# EAGLE schematic G80_a (EAGLE 8.2.2)
CPU-Board II auf Basis Modul G80 SoC von GHI-Electornics, LLC STM32F427xx

## Sheet 1 of 10: Prozessor
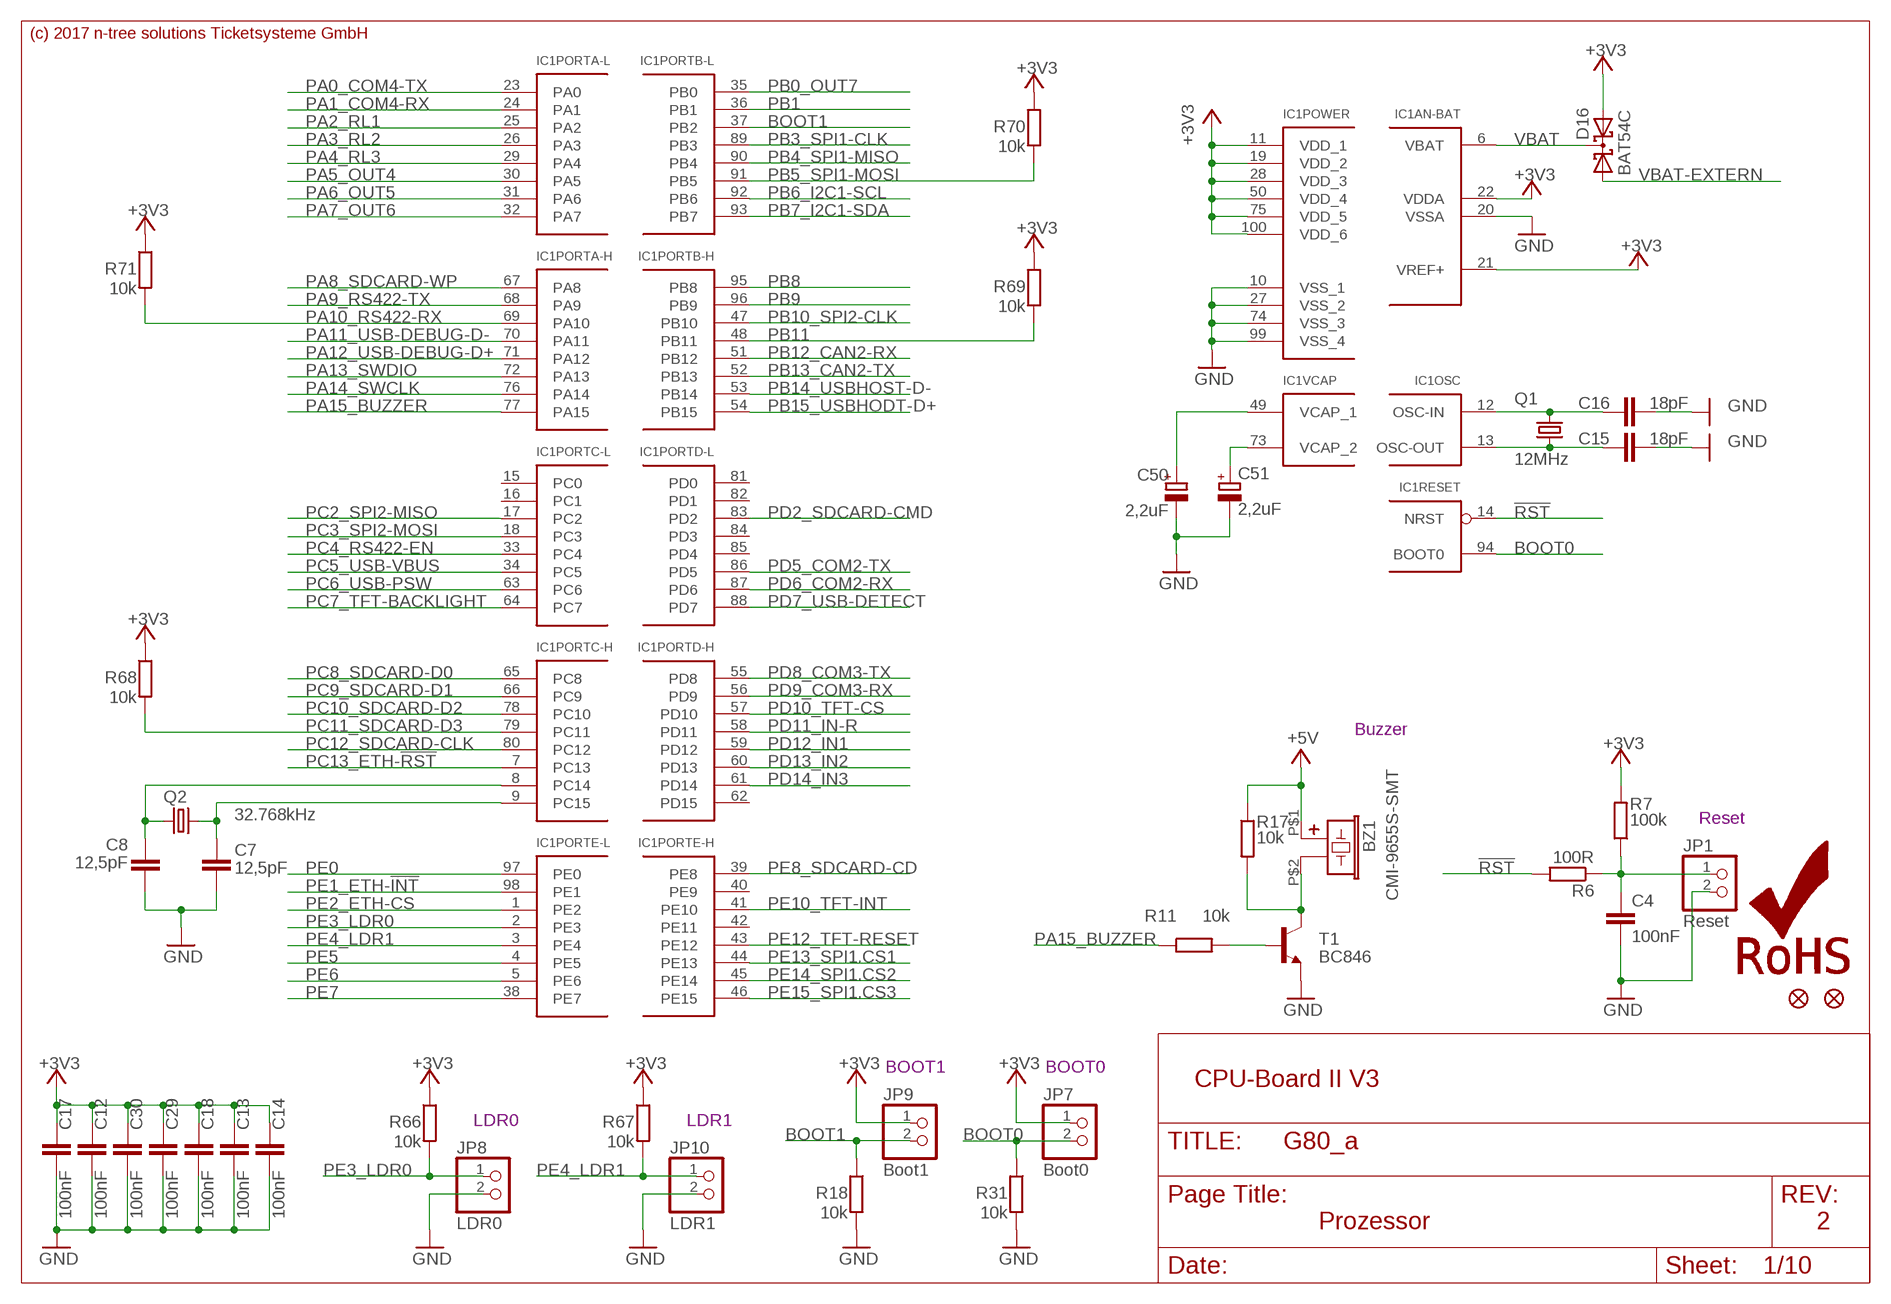
[diagram p0: schematic, sheet 1]

### Parts
BZ1  CMI-9655S-SMT  KTG0905CL  [KTG0905CL]
C4  100nF  C-EUC0603  [C0603]
C7  12,5pF  C-EUC0603  [C0603]
C8  12,5pF  C-EUC0603  [C0603]
C12  100nF  C-EUC0603  [C0603]
C13  100nF  C-EUC0603  [C0603]
C14  100nF  C-EUC0603  [C0603]
C15  18pF  C-EUC0603  [C0603]
C16  18pF  C-EUC0603  [C0603]
C17  100nF  C-EUC0603  [C0603]
C18  100nF  C-EUC0603  [C0603]
C29  100nF  C-EUC0603  [C0603]
C30  100nF  C-EUC0603  [C0603]
C50  2,2uF  CPOL-EUCT3216  [CT3216]
C51  2,2uF  CPOL-EUCT3216  [CT3216]
D16  BAT54C  [SOT23]
FID1  FIDUCIAL1X2  [FIDUCIAL-1X2]
FID2  FIDUCIAL1X2  [FIDUCIAL-1X2]
IC1  STM32F107  G80_SOC  [LQFP100]
JP1  Reset  PINHD-1X2  [1X02]
JP7  Boot0  PINHD-1X2  [1X02]
JP8  LDR0  PINHD-1X2  [1X02]
JP9  Boot1  PINHD-1X2  [1X02]
JP10  LDR1  PINHD-1X2  [1X02]
LOGO1  ROHS_LOGO  [ROHS_LOGO_0.18_IN]
Q1  12MHz  CRYSTALCTS406  [CTS406]
Q2  32.768kHz  CRYSTALS-NOGND-CFPX-217  [3.2X1.5-2-PAD]
R6  100R  R-EU_R0603  [R0603]
R7  100k  R-EU_R0603  [R0603]
R11  10k  R-EU_R0603  [R0603]
R17  10k  R-EU_R0603  [R0603]
R18  10k  R-EU_R0603  [R0603]
R31  10k  R-EU_R0603  [R0603]
R66  10k  R-EU_R0603  [R0603]
R67  10k  R-EU_R0603  [R0603]
R68  10k  R-EU_R0603  [R0603]
R69  10k  R-EU_R0603  [R0603]
R70  10k  R-EU_R0603  [R0603]
R71  10k  R-EU_R0603  [R0603]
T1  BC846  [SOT23]

### Nets
!RST: IC1.14(RESET:NRST) R6.2 ; also sheet 2
+3V3 [24V AC Signal]: C12.1 C13.1 C14.1 C17.1 C18.1 C29.1 C30.1 D16.2(A2) IC1.11(POWER:VDD_1) IC1.19(POWER:VDD_2) IC1.21(AN-BAT:VREF+) IC1.22(AN-BAT:VDDA) IC1.28(POWER:VDD_3) IC1.50(POWER:VDD_4) IC1.75(POWER:VDD_5) IC1.100(POWER:VDD_6) JP7.1 JP9.1 R7.2 R66.1 R67.1 R68.1 R69.1 R70.1 R71.1 ; also sheet 2,3,4,5,6,8,9,10
+5V [24V AC Signal]: BZ1.P$1 R17.1 ; also sheet 2,4,5,6,7,8,9,10
BOOT0: IC1.94(RESET:BOOT0) JP7.2 R31.1
BOOT1: IC1.37(PORTB-L:PB2) JP9.2 R18.1
GND: C4.2 C7.2 C8.2 C12.2 C13.2 C14.2 C15.2 C16.2 C17.2 C18.2 C29.2 C30.2 C50.- C51.- IC1.10(POWER:VSS_1) IC1.20(AN-BAT:VSSA) IC1.27(POWER:VSS_2) IC1.74(POWER:VSS_3) IC1.99(POWER:VSS_4) JP1.2 JP8.2 JP10.2 R18.2 R31.2 T1.2(E) ; also sheet 2,3,4,5,6,8,9,10
N$1: C15.1 IC1.13(OSC:OSC-OUT) Q1.1
N$2: C16.1 IC1.12(OSC:OSC-IN) Q1.3
N$3: C7.1 IC1.9(PORTC-H:PC15) Q2.2
N$4: C8.1 IC1.8(PORTC-H:PC14) Q2.1
N$8: C51.+ IC1.73(VCAP:VCAP_2)
N$28: BZ1.P$2 R17.2 T1.3(C)
N$29: R11.2 T1.1(B)
N$31: C4.1 JP1.1 R6.1 R7.1
N$69: C50.+ IC1.49(VCAP:VCAP_1)
PA0_COM4-TX: IC1.23(PORTA-L:PA0) ; also sheet 4
PA1_COM4-RX: IC1.24(PORTA-L:PA1) ; also sheet 4
PA2_RL1: IC1.25(PORTA-L:PA2) ; also sheet 7
PA3_RL2: IC1.26(PORTA-L:PA3) ; also sheet 7
PA4_RL3: IC1.29(PORTA-L:PA4) ; also sheet 7
PA5_OUT4: IC1.30(PORTA-L:PA5) ; also sheet 2,7
PA6_OUT5: IC1.31(PORTA-L:PA6) ; also sheet 2,7
PA7_OUT6: IC1.32(PORTA-L:PA7) ; also sheet 2,7
PA8_SDCARD-WP: IC1.67(PORTA-H:PA8)
PA9_RS422-TX: IC1.68(PORTA-H:PA9) ; also sheet 9
PA10_RS422-RX: IC1.69(PORTA-H:PA10) R71.2 ; also sheet 9
PA11_USB-DEBUG-D-: IC1.70(PORTA-H:PA11) ; also sheet 6
PA12_USB-DEBUG-D+: IC1.71(PORTA-H:PA12) ; also sheet 6
PA13_SWDIO: IC1.72(PORTA-H:PA13) ; also sheet 2
PA14_SWCLK: IC1.76(PORTA-H:PA14) ; also sheet 2
PA15_BUZZER: IC1.77(PORTA-H:PA15) R11.1
PB0_OUT7: IC1.35(PORTB-L:PB0) ; also sheet 2,7
PB1: IC1.36(PORTB-L:PB1) ; also sheet 2
PB3_SPI1-CLK: IC1.89(PORTB-L:PB3) ; also sheet 2,5
PB4_SPI1-MISO: IC1.90(PORTB-L:PB4) ; also sheet 2,5
PB5_SPI1-MOSI: IC1.91(PORTB-L:PB5) R70.2 ; also sheet 2,5
PB6_I2C1-SCL: IC1.92(PORTB-L:PB6) ; also sheet 2,6
PB7_I2C1-SDA: IC1.93(PORTB-L:PB7) ; also sheet 2,6
PB8: IC1.95(PORTB-H:PB8) ; also sheet 2
PB9: IC1.96(PORTB-H:PB9) ; also sheet 2
PB10_SPI2-CLK: IC1.47(PORTB-H:PB10) ; also sheet 3
PB11: IC1.48(PORTB-H:PB11) R69.2 ; also sheet 2
PB12_CAN2-RX: IC1.51(PORTB-H:PB12) ; also sheet 2
PB13_CAN2-TX: IC1.52(PORTB-H:PB13) ; also sheet 2
PB14_USBHOST-D-: IC1.53(PORTB-H:PB14) ; also sheet 6
PB15_USBHODT-D+: IC1.54(PORTB-H:PB15) ; also sheet 6
PC2_SPI2-MISO: IC1.17(PORTC-L:PC2) ; also sheet 3
PC3_SPI2-MOSI: IC1.18(PORTC-L:PC3) ; also sheet 3
PC4_RS422-EN: IC1.33(PORTC-L:PC4) ; also sheet 9
PC5_USB-VBUS: IC1.34(PORTC-L:PC5) ; also sheet 6
PC6_USB-PSW: IC1.63(PORTC-L:PC6) ; also sheet 6
PC7_TFT-BACKLIGHT: IC1.64(PORTC-L:PC7) ; also sheet 5
PC8_SDCARD-D0: IC1.65(PORTC-H:PC8) ; also sheet 6
PC9_SDCARD-D1: IC1.66(PORTC-H:PC9) ; also sheet 6
PC10_SDCARD-D2: IC1.78(PORTC-H:PC10) ; also sheet 6
PC11_SDCARD-D3: IC1.79(PORTC-H:PC11) R68.2 ; also sheet 6
PC12_SDCARD-CLK: IC1.80(PORTC-H:PC12) ; also sheet 6
PC13_ETH-!RST: IC1.7(PORTC-H:PC13) ; also sheet 3
PD2_SDCARD-CMD: IC1.83(PORTD-L:PD2) ; also sheet 6
PD5_COM2-TX: IC1.86(PORTD-L:PD5) ; also sheet 4
PD6_COM2-RX: IC1.87(PORTD-L:PD6) ; also sheet 4
PD7_USB-DETECT: IC1.88(PORTD-L:PD7) ; also sheet 6
PD8_COM3-TX: IC1.55(PORTD-H:PD8) ; also sheet 4
PD9_COM3-RX: IC1.56(PORTD-H:PD9) ; also sheet 4
PD10_TFT-CS: IC1.57(PORTD-H:PD10) ; also sheet 5
PD11_IN-R: IC1.58(PORTD-H:PD11) ; also sheet 8
PD12_IN1: IC1.59(PORTD-H:PD12) ; also sheet 8
PD13_IN2: IC1.60(PORTD-H:PD13) ; also sheet 8
PD14_IN3: IC1.61(PORTD-H:PD14) ; also sheet 8
PE0: IC1.97(PORTE-L:PE0) ; also sheet 2
PE1_ETH-!INT: IC1.98(PORTE-L:PE1) ; also sheet 3
PE2_ETH-CS: IC1.1(PORTE-L:PE2) ; also sheet 3
PE3_LDR0: IC1.2(PORTE-L:PE3) JP8.1 R66.2
PE4_LDR1: IC1.3(PORTE-L:PE4) JP10.1 R67.2
PE5: IC1.4(PORTE-L:PE5) ; also sheet 2
PE6: IC1.5(PORTE-L:PE6) ; also sheet 2
PE7: IC1.38(PORTE-L:PE7) ; also sheet 2
PE8_SDCARD-CD: IC1.39(PORTE-H:PE8) ; also sheet 6
PE10_TFT-INT: IC1.41(PORTE-H:PE10) ; also sheet 5
PE12_TFT-RESET: IC1.43(PORTE-H:PE12) ; also sheet 5
PE13_SPI1.CS1: IC1.44(PORTE-H:PE13) ; also sheet 2
PE14_SPI1.CS2: IC1.45(PORTE-H:PE14) ; also sheet 2
PE15_SPI1.CS3: IC1.46(PORTE-H:PE15) ; also sheet 2
VBAT: D16.3(CC) IC1.6(AN-BAT:VBAT)
VBAT-EXTERN: D16.1(A1) ; also sheet 2
Unconnected: IC1.15(PORTC-L:PC0) IC1.16(PORTC-L:PC1) IC1.40(PORTE-H:PE9) IC1.42(PORTE-H:PE11) IC1.62(PORTD-H:PD15) IC1.81(PORTD-L:PD0) IC1.82(PORTD-L:PD1) IC1.84(PORTD-L:PD3) IC1.85(PORTD-L:PD4)

### Notes on the sheet
- (c) 2017 n-tree solutions Ticketsysteme GmbH
- Buzzer
- Reset
- BOOT1 | BOOT0
- CPU-Board II V3
- LDR0 | LDR1
- Prozessor | 2

## Sheet 2 of 10: Extern
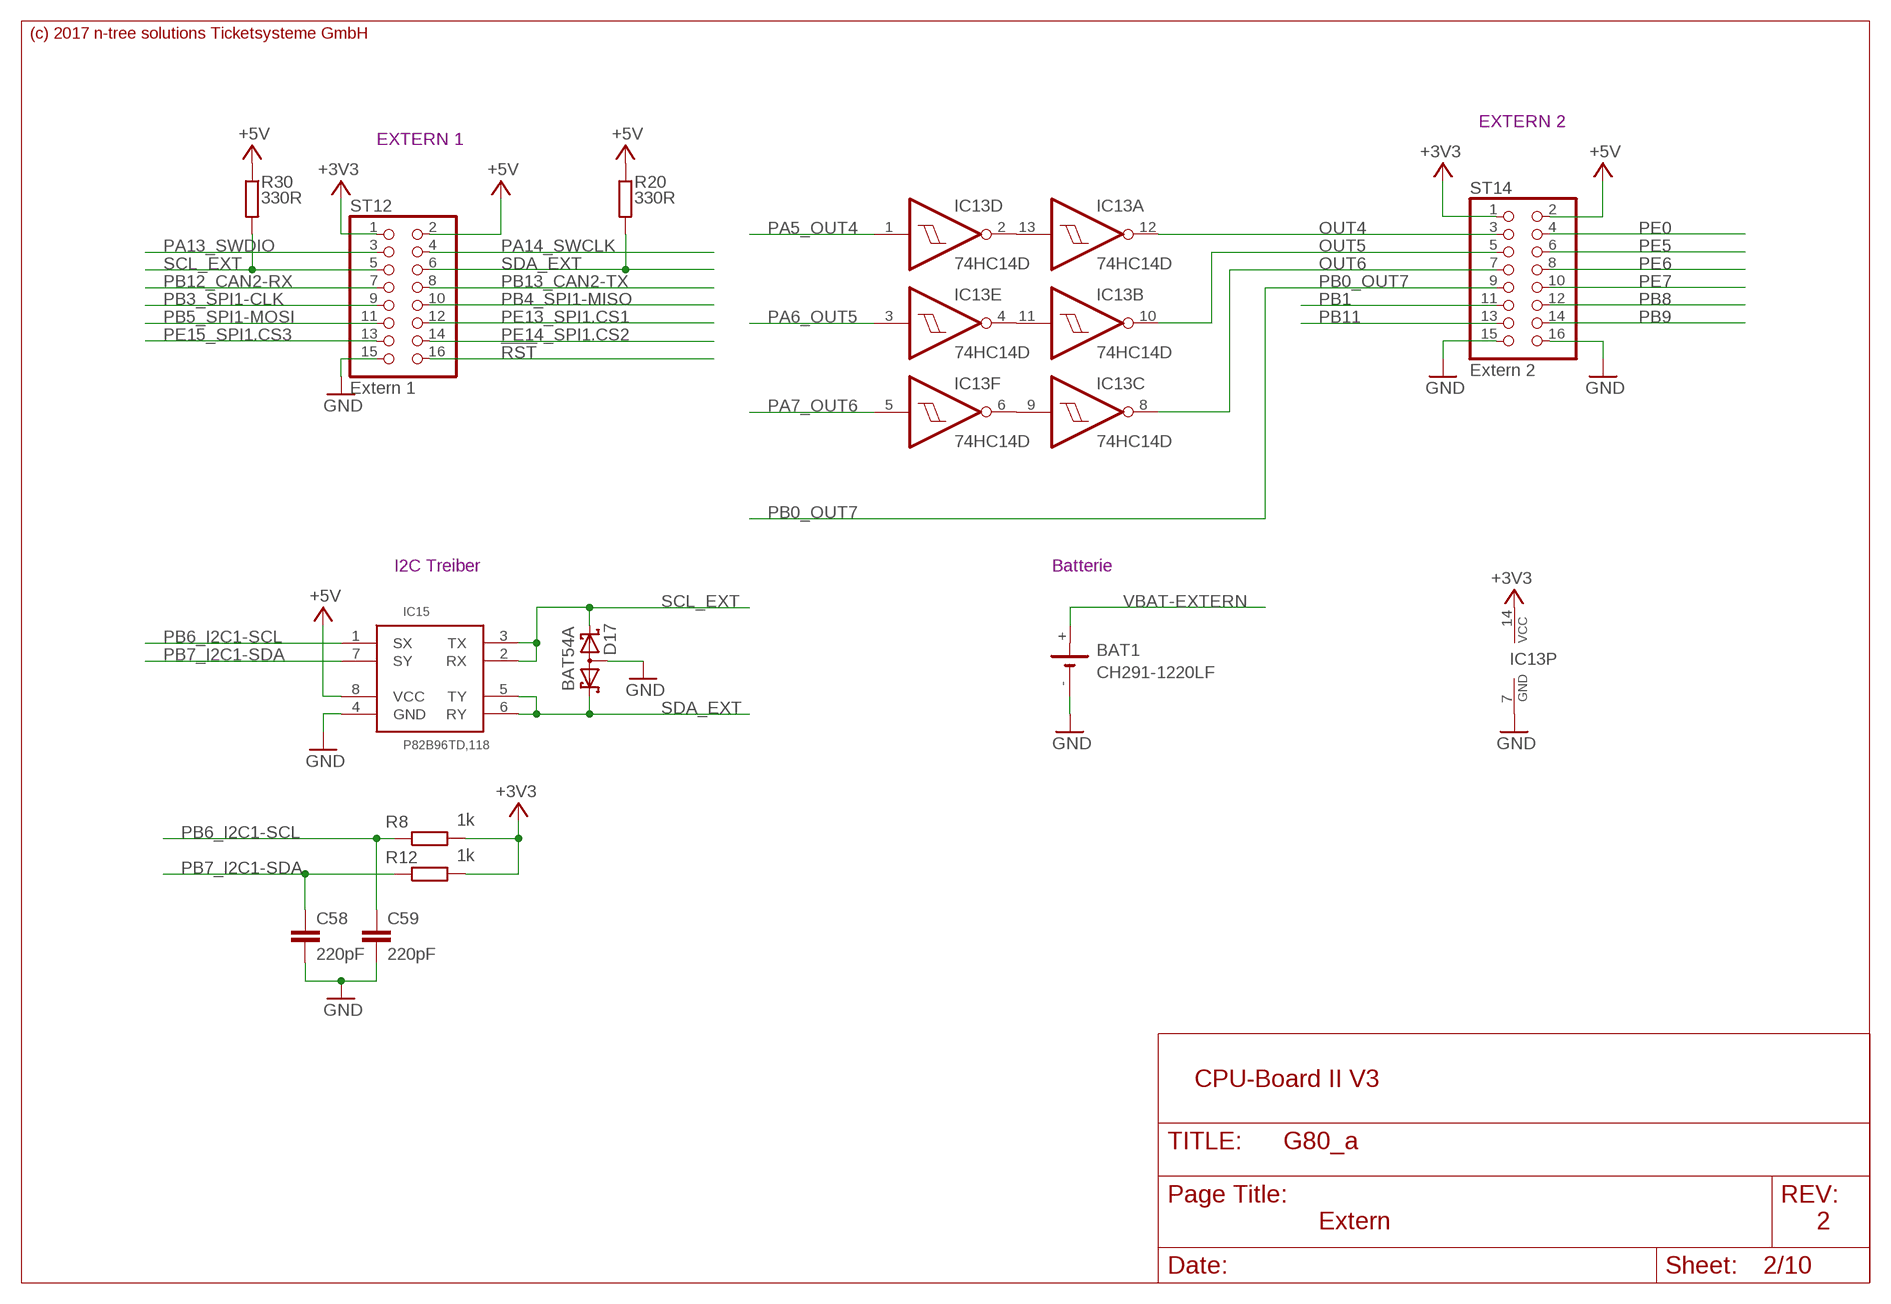
[diagram p1: schematic, sheet 2]

### Parts
BAT1  CH291-1220LF  [CH291-1220LF]
C58  220pF  C-EUC0603  [C0603]
C59  220pF  C-EUC0603  [C0603]
D17  BAT54A  [SOT23]
IC13  74HC14D  [SO14]
IC15  P82B96TD,118  P82B96'SO8'  [SO08]
R8  1k  R-EU_R0603  [R0603]
R12  1k  R-EU_R0603  [R0603]
R20  330R  R-EU_R0603  [R0603]
R30  330R  R-EU_R0603  [R0603]
ST12  Extern 1  PINHD-2X8  [2X08]
ST14  Extern 2  PINHD-2X8  [2X08]

### Nets
!RST: ST12.16 ; also sheet 1
+3V3 [24V AC Signal]: IC13.14(P:VCC) R8.2 R12.2 ST12.1 ST14.1 ; also sheet 1,3,4,5,6,8,9,10
+5V [24V AC Signal]: IC15.8(VCC) R20.1 R30.1 ST12.2 ST14.2 ; also sheet 1,4,5,6,7,8,9,10
GND: BAT1.- C58.2 C59.2 D17.3(AA) IC13.7(P:GND) IC15.4(GND) ST12.15 ST14.15 ST14.16 ; also sheet 1,3,4,5,6,8,9,10
N$94: IC13.2(D:O) IC13.13(A:I)
N$100: IC13.4(E:O) IC13.11(B:I)
N$103: IC13.6(F:O) IC13.9(C:I)
OUT4: IC13.12(A:O) ST14.3 ; also sheet 7
OUT5: IC13.10(B:O) ST14.5 ; also sheet 7
OUT6: IC13.8(C:O) ST14.7 ; also sheet 7
PA5_OUT4: IC13.1(D:I) ; also sheet 1,7
PA6_OUT5: IC13.3(E:I) ; also sheet 1,7
PA7_OUT6: IC13.5(F:I) ; also sheet 1,7
PA13_SWDIO: ST12.3 ; also sheet 1
PA14_SWCLK: ST12.4 ; also sheet 1
PB0_OUT7: ST14.9 ; also sheet 1,7
PB1: ST14.11 ; also sheet 1
PB3_SPI1-CLK: ST12.9 ; also sheet 1,5
PB4_SPI1-MISO: ST12.10 ; also sheet 1,5
PB5_SPI1-MOSI: ST12.11 ; also sheet 1,5
PB6_I2C1-SCL: C59.1 IC15.1(SX) R8.1 ; also sheet 1,6
PB7_I2C1-SDA: C58.1 IC15.7(SY) R12.1 ; also sheet 1,6
PB8: ST14.12 ; also sheet 1
PB9: ST14.14 ; also sheet 1
PB11: ST14.13 ; also sheet 1
PB12_CAN2-RX: ST12.7 ; also sheet 1
PB13_CAN2-TX: ST12.8 ; also sheet 1
PE0: ST14.4 ; also sheet 1
PE5: ST14.6 ; also sheet 1
PE6: ST14.8 ; also sheet 1
PE7: ST14.10 ; also sheet 1
PE13_SPI1.CS1: ST12.12 ; also sheet 1
PE14_SPI1.CS2: ST12.14 ; also sheet 1
PE15_SPI1.CS3: ST12.13 ; also sheet 1
SCL_EXT: D17.2(K2) IC15.2(RX) IC15.3(TX) R30.2 ST12.5
SDA_EXT: D17.1(K1) IC15.5(TY) IC15.6(RY) R20.2 ST12.6
VBAT-EXTERN: BAT1.+ ; also sheet 1

### Notes on the sheet
- (c) 2017 n-tree solutions Ticketsysteme GmbH
- EXTERN 2
- EXTERN 1
- I2C Treiber | Batterie
- CPU-Board II V3
- Extern | 2

## Sheet 3 of 10: Netzwerk
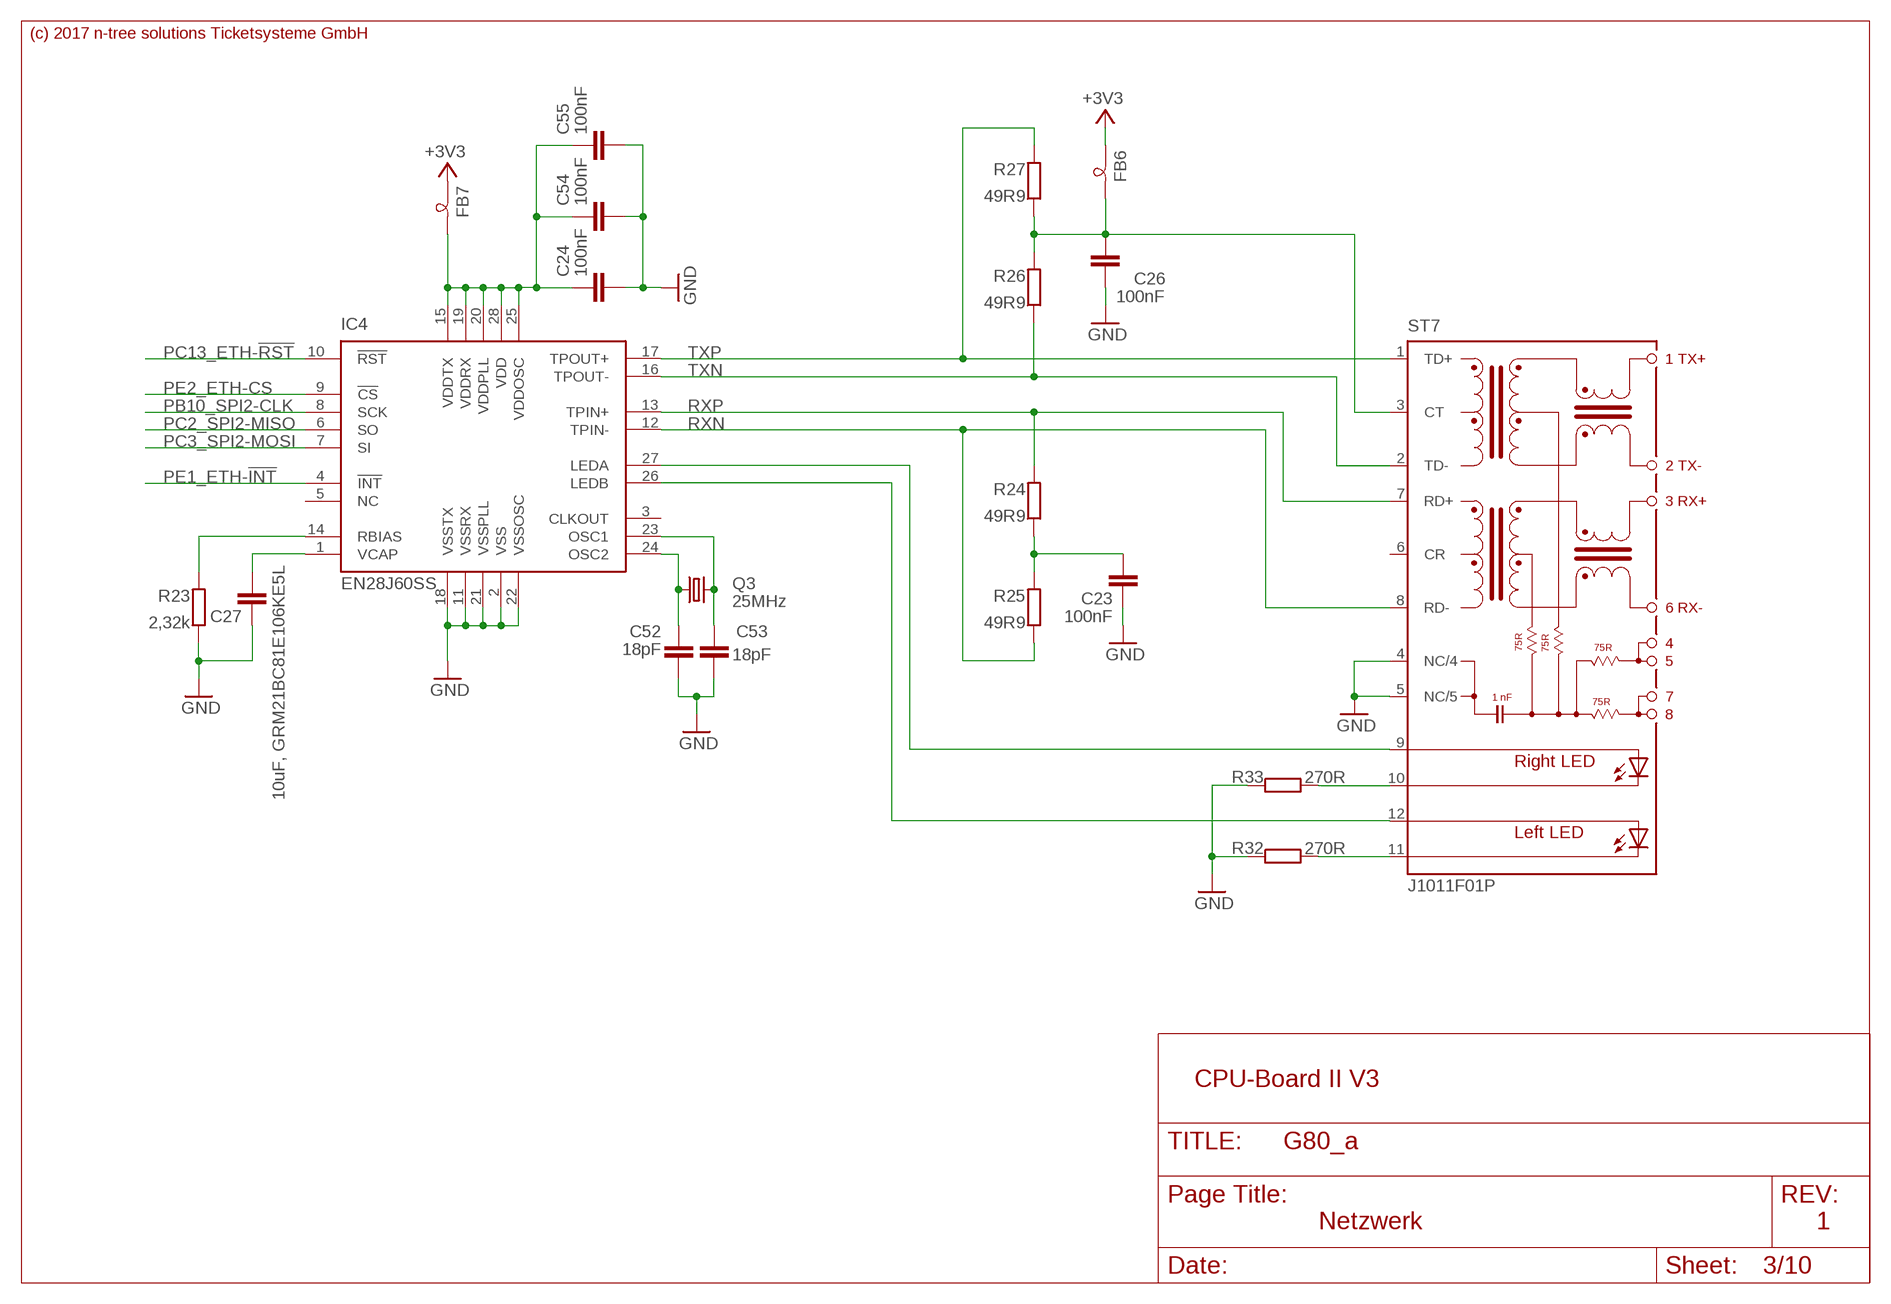
[diagram p2: schematic, sheet 3]

### Parts
C23  100nF  C-EUC0603  [C0603]
C24  100nF  C-EUC0603  [C0603]
C26  100nF  C-EUC0603  [C0603]
C27  10uF, GRM21BC81E106KE5L  C-EUC0805  [C0805]
C52  18pF  C-EUC0603  [C0603]
C53  18pF  C-EUC0603  [C0603]
C54  100nF  C-EUC0603  [C0603]
C55  100nF  C-EUC0603  [C0603]
FB6  FERITTE-CHIP-BEAD  [R805]
FB7  FERITTE-CHIP-BEAD  [R805]
IC4  EN28J60SS  [SSOP28]
Q3  25MHz  CRYSTALCTS406  [CTS406]
R23  2,32k  R-EU_R0603  [R0603]
R24  49R9  R-EU_R0603  [R0603]
R25  49R9  R-EU_R0603  [R0603]
R26  49R9  R-EU_R0603  [R0603]
R27  49R9  R-EU_R0603  [R0603]
R32  270R  R-EU_R0603  [R0603]
R33  270R  R-EU_R0603  [R0603]
ST7  J1011F01P  [J1]

### Nets
+3V3 [24V AC Signal]: FB6.1 FB7.1 ; also sheet 1,2,4,5,6,8,9,10
GND: C23.2 C24.2 C26.2 C27.2 C52.2 C53.2 C54.2 C55.2 IC4.2(VSS) IC4.11(VSSRX) IC4.18(VSSTX) IC4.21(VSSPLL) IC4.22(VSSOSC) R23.1 R32.1 R33.1 ST7.4(NC/4) ST7.5(NC/5) ; also sheet 1,2,4,5,6,8,9,10
N$5: R33.2 ST7.10(C-R)
N$6: R32.2 ST7.11(C-L)
N$7: IC4.27(LEDA) ST7.9(A-R)
N$9: IC4.26(LEDB) ST7.12(AL)
N$25 [24V AC Signal]: C24.1 C54.1 C55.1 FB7.2 IC4.15(VDDTX) IC4.19(VDDRX) IC4.20(VDDPLL) IC4.25(VDDOSC) IC4.28(VDD)
N$71: C23.1 R24.1 R25.2
N$73: C26.1 FB6.2 R26.2 R27.1 ST7.3(CT)
N$74: C52.1 IC4.24(OSC2) Q3.1
N$76: C53.1 IC4.23(OSC1) Q3.3
N$77: C27.1 IC4.1(VCAP)
N$81: IC4.14(RBIAS) R23.2
PB10_SPI2-CLK: IC4.8(SCK) ; also sheet 1
PC2_SPI2-MISO: IC4.6(SO) ; also sheet 1
PC3_SPI2-MOSI: IC4.7(SI) ; also sheet 1
PC13_ETH-!RST: IC4.10(!RST) ; also sheet 1
PE1_ETH-!INT: IC4.4(!INT) ; also sheet 1
PE2_ETH-CS: IC4.9(!CS) ; also sheet 1
RXN: IC4.12(TPIN-) R25.1 ST7.8(RD-)
RXP: IC4.13(TPIN+) R24.2 ST7.7(RD+)
TXN: IC4.16(TPOUT-) R26.1 ST7.2(TD-)
TXP: IC4.17(TPOUT+) R27.2 ST7.1(TD+)
Unconnected: IC4.3(CLKOUT) IC4.5(NC) ST7.6(CR)

### Notes on the sheet
- (c) 2017 n-tree solutions Ticketsysteme GmbH
- CPU-Board II V3
- Netzwerk | 1

## Sheet 4 of 10: Serielle Schnittstellen
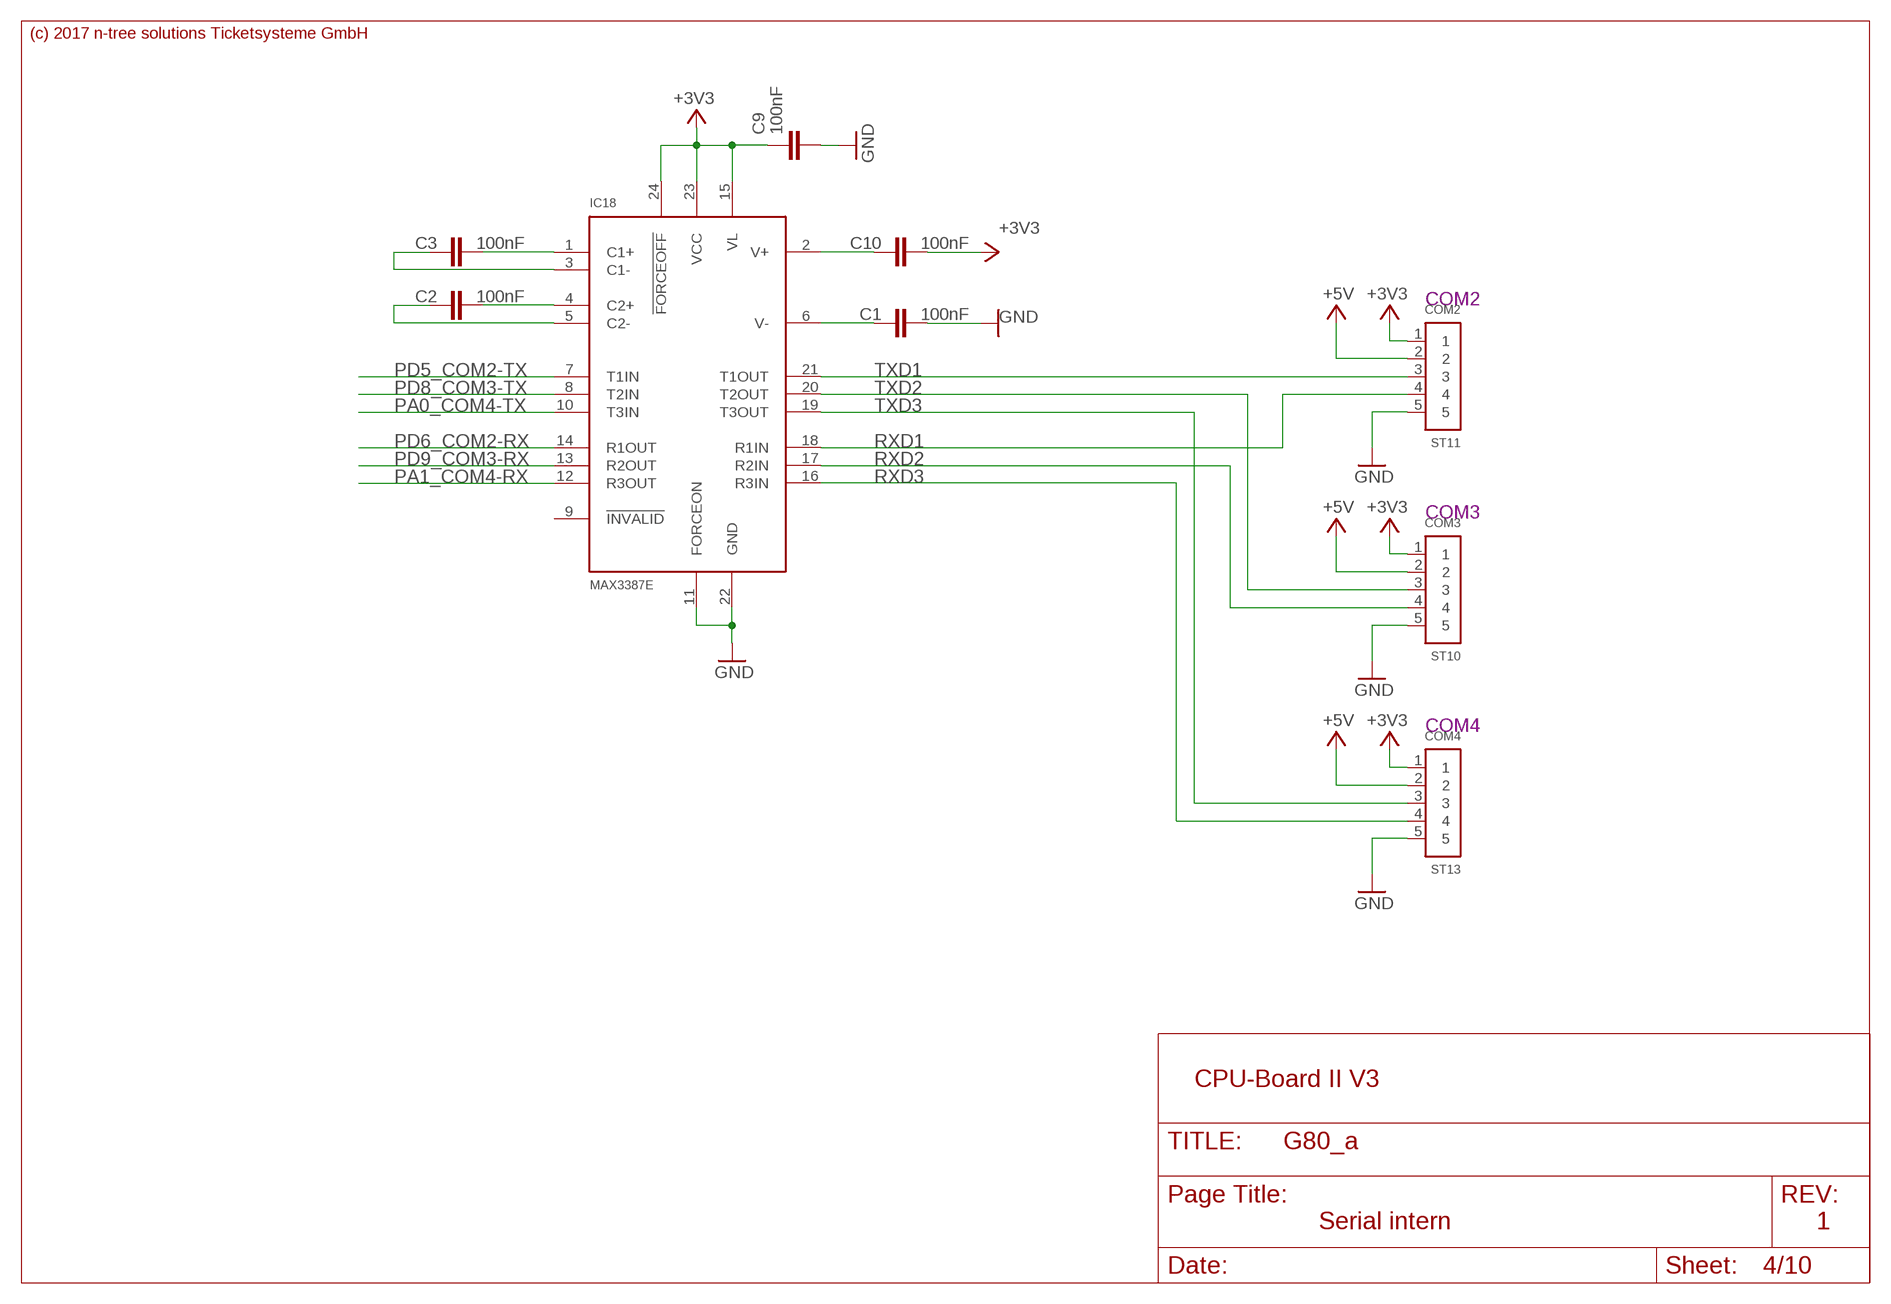
[diagram p3: schematic, sheet 4]

### Parts
C1  100nF  C-EUC0603  [C0603]
C2  100nF  C-EUC0603  [C0603]
C3  100nF  C-EUC0603  [C0603]
C9  100nF  C-EUC0603  [C0603]
C10  100nF  C-EUC0603  [C0603]
IC18  MAX3387E  [SSOP24]
ST10  COM3  JST-EH5  [JST-EH5]
ST11  COM2  JST-EH5  [JST-EH5]
ST13  COM4  JST-EH5  [JST-EH5]

### Nets
+3V3 [24V AC Signal]: C9.1 C10.2 IC18.15(VL) IC18.23(VCC) IC18.24(!FORCEOFF) ST10.1 ST11.1 ST13.1 ; also sheet 1,2,3,5,6,8,9,10
+5V [24V AC Signal]: ST10.2 ST11.2 ST13.2 ; also sheet 1,2,5,6,7,8,9,10
GND: C1.2 C9.2 IC18.11(FORCEON) IC18.22(GND) ST10.5 ST11.5 ST13.5 ; also sheet 1,2,3,5,6,8,9,10
N$10: C3.2 IC18.1(C1+)
N$11: C3.1 IC18.3(C1-)
N$12: C2.2 IC18.4(C2+)
N$13: C2.1 IC18.5(C2-)
N$14: C10.1 IC18.2(V+)
N$15: C1.1 IC18.6(V-)
PA0_COM4-TX: IC18.10(T3IN) ; also sheet 1
PA1_COM4-RX: IC18.12(R3OUT) ; also sheet 1
PD5_COM2-TX: IC18.7(T1IN) ; also sheet 1
PD6_COM2-RX: IC18.14(R1OUT) ; also sheet 1
PD8_COM3-TX: IC18.8(T2IN) ; also sheet 1
PD9_COM3-RX: IC18.13(R2OUT) ; also sheet 1
RXD1: IC18.18(R1IN) ST11.4
RXD2: IC18.17(R2IN) ST10.4
RXD3: IC18.16(R3IN) ST13.4
TXD1: IC18.21(T1OUT) ST11.3
TXD2: IC18.20(T2OUT) ST10.3
TXD3: IC18.19(T3OUT) ST13.3
Unconnected: IC18.9(!INVALID)

### Notes on the sheet
- (c) 2017 n-tree solutions Ticketsysteme GmbH
- COM2
- COM3
- COM4
- CPU-Board II V3
- Serial intern | 1

## Sheet 5 of 10: LCD-Display
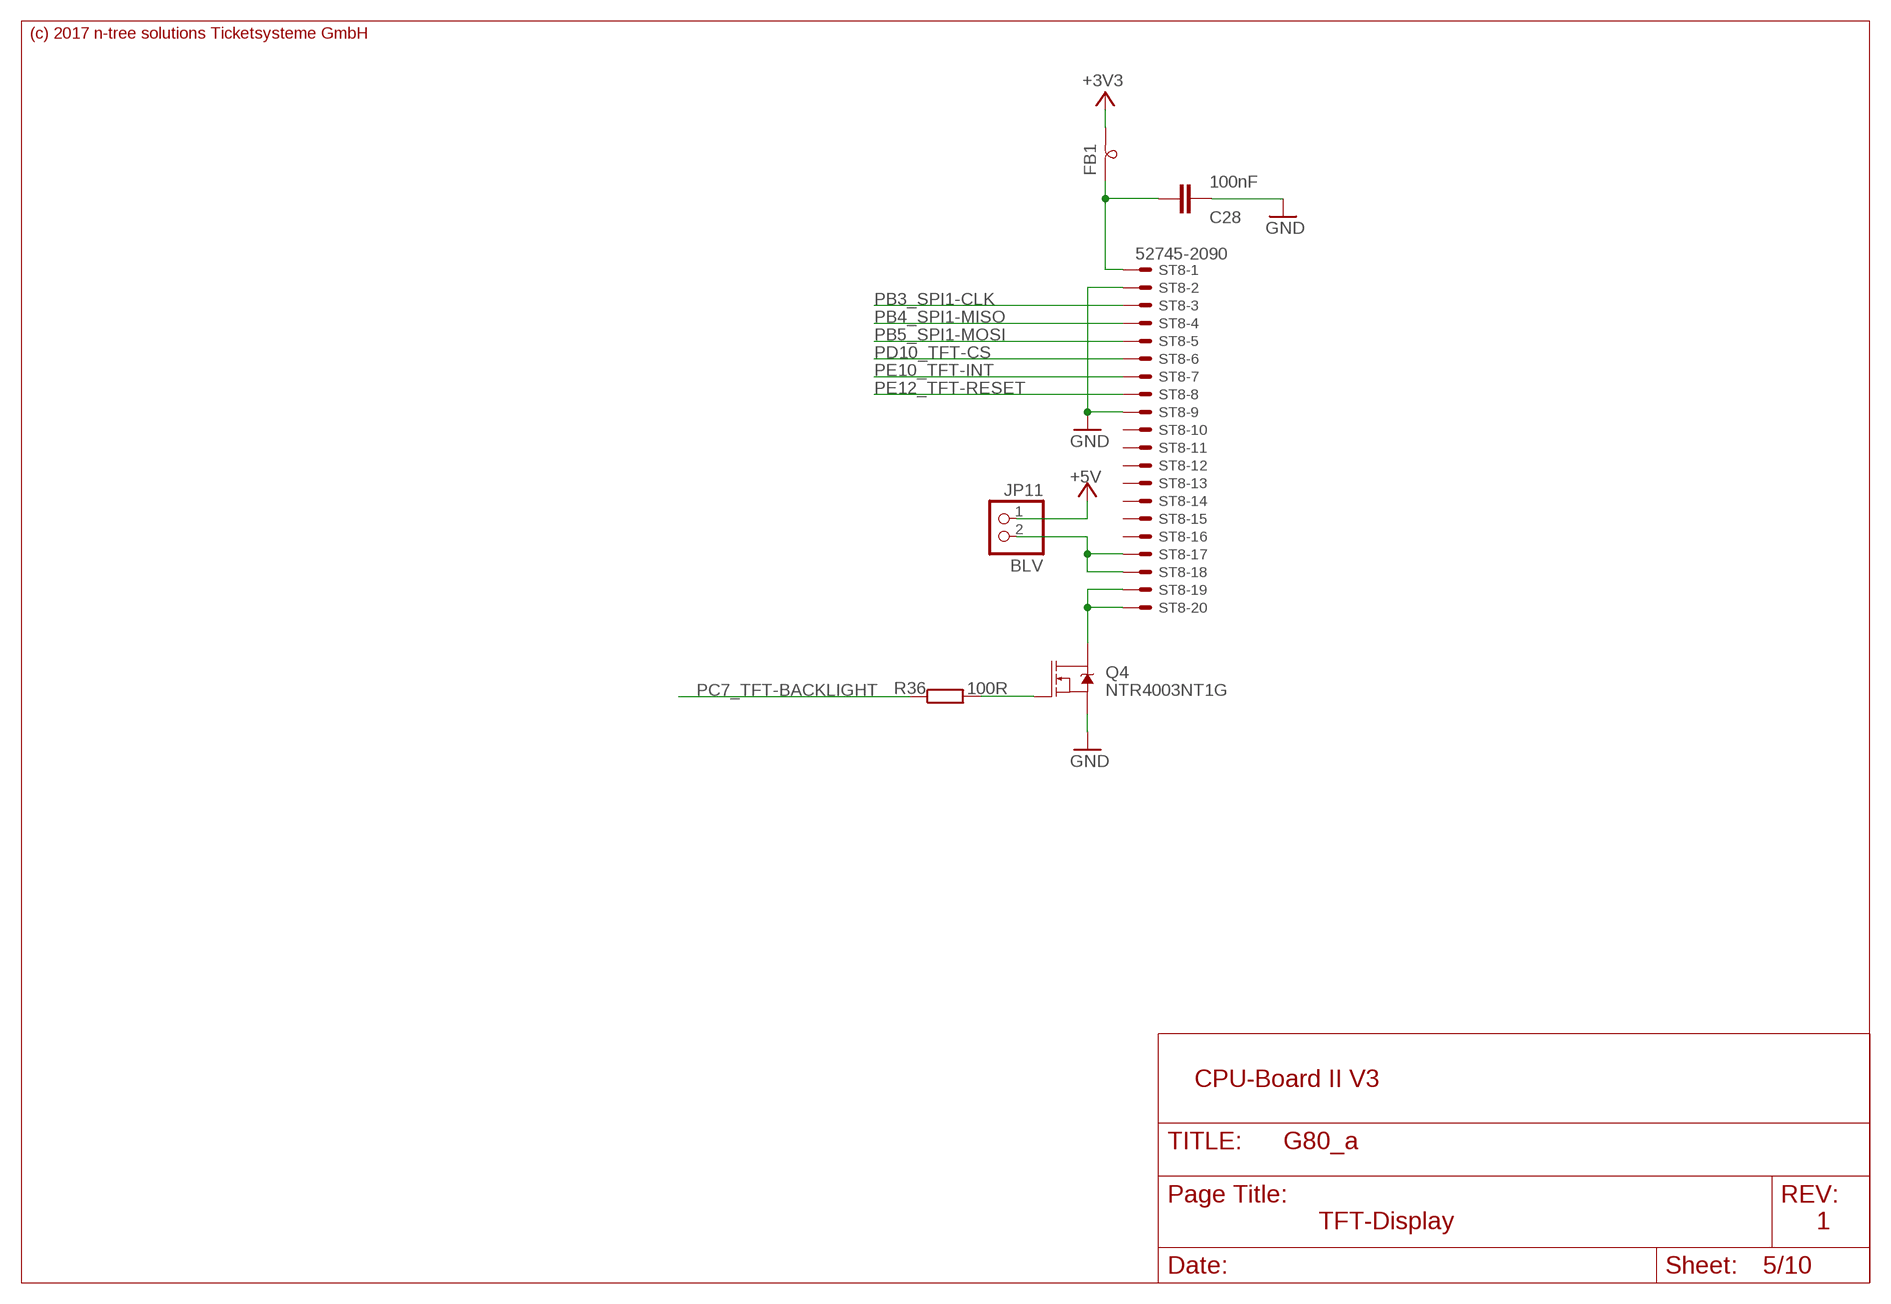
[diagram p4: schematic, sheet 5]

### Parts
C28  100nF  C-EUC0603  [C0603]
FB1  FERITTE-CHIP-BEAD  [R805]
JP11  BLV  PINHD-1X2  [1X02]
Q4  NTR4003NT1G  MOSFET-NCH-BSS138  [SOT23-3]
R36  100R  R-EU_R0603  [R0603]
ST8  52745-2090  [52745-2090]

### Nets
+3V3 [24V AC Signal]: FB1.2 ; also sheet 1,2,3,4,6,8,9,10
+5V [24V AC Signal]: JP11.1 ; also sheet 1,2,4,6,7,8,9,10
GND: C28.2 Q4.2(S) ST8.2 ST8.9 ; also sheet 1,2,3,4,6,8,9,10
N$33: Q4.1(G) R36.2
N$39 [24V AC Signal]: C28.1 FB1.1 ST8.1
N$104: Q4.3(D) ST8.19 ST8.20
N$105 [24V AC Signal]: JP11.2 ST8.17 ST8.18
PB3_SPI1-CLK: ST8.3 ; also sheet 1,2
PB4_SPI1-MISO: ST8.4 ; also sheet 1,2
PB5_SPI1-MOSI: ST8.5 ; also sheet 1,2
PC7_TFT-BACKLIGHT: R36.1 ; also sheet 1
PD10_TFT-CS: ST8.6 ; also sheet 1
PE10_TFT-INT: ST8.7 ; also sheet 1
PE12_TFT-RESET: ST8.8 ; also sheet 1
Unconnected: ST8.10 ST8.11 ST8.12 ST8.13 ST8.14 ST8.15 ST8.16

### Notes on the sheet
- (c) 2017 n-tree solutions Ticketsysteme GmbH
- CPU-Board II V3
- TFT-Display | 1

## Sheet 6 of 10
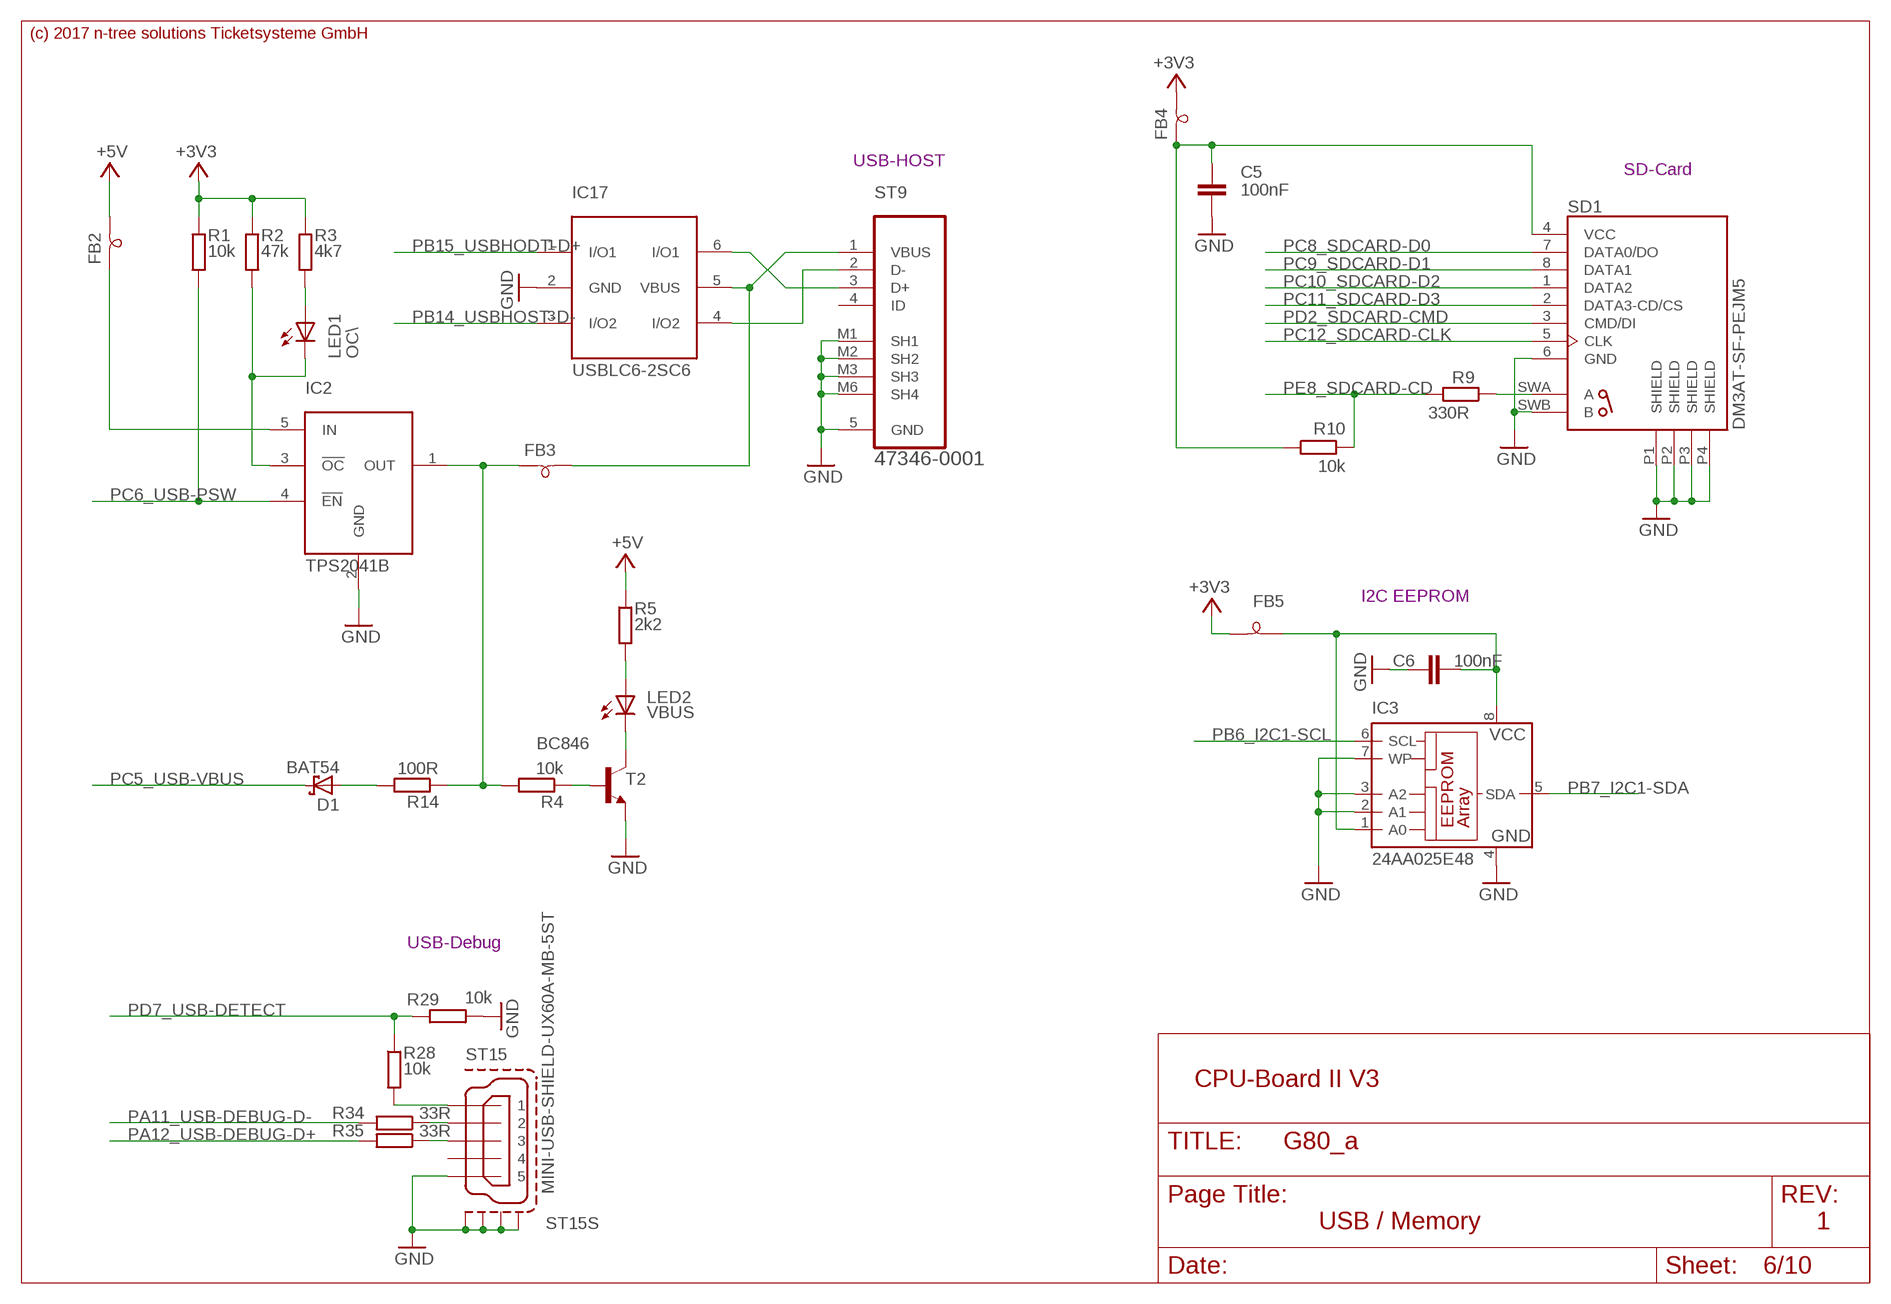
[diagram p5: schematic, sheet 6]

### Parts
C5  100nF  C-EUC0603  [C0603]
C6  100nF  C-EUC0603  [C0603]
D1  BAT54  [SOT23]
FB2  FERITTE-CHIP-BEAD  [R805]
FB3  FERITTE-CHIP-BEAD  [R805]
FB4  FERITTE-CHIP-BEAD  [R805]
FB5  FERITTE-CHIP-BEAD  [R805]
IC2  TPS2041B  [SOT23-5]
IC3  24AA025E48  24AA01SM  [SO-08M]
IC17  USBLC6-2SC6  [SO23-6L]
LED1  OC\  LEDCHIPLED_0603  [CHIPLED_0603]
LED2  VBUS  LEDCHIPLED_0603  [CHIPLED_0603]
R1  10k  R-EU_R0603  [R0603]
R2  47k  R-EU_R0603  [R0603]
R3  4k7  R-EU_R0603  [R0603]
R4  10k  R-EU_R0603  [R0603]
R5  2k2  R-EU_R0603  [R0603]
R9  330R  R-EU_R0603  [R0603]
R10  10k  R-EU_R0603  [R0603]
R14  100R  R-EU_R0603  [R0603]
R28  10k  R-EU_R0603  [R0603]
R29  10k  R-EU_R0603  [R0603]
R34  33R  R-EU_R0603  [R0603]
R35  33R  R-EU_R0603  [R0603]
SD1  DM3AT-SF-PEJM5  [HRS_DM3AT-SF-PEJM5]
ST9  47346-0001  [MOLEX_47346-0001]
ST15  MINI-USB-SHIELD-UX60A-MB-5ST  [UX60A-MB-5ST]
T2  BC846  BC846-NPN-SOT23-BEC  [SOT23-BEC]

### Nets
+3V3 [24V AC Signal]: FB4.2 FB5.2 R1.1 R2.1 R3.1 ; also sheet 1,2,3,4,5,8,9,10
+5V [24V AC Signal]: FB2.2 R5.1 ; also sheet 1,2,4,5,7,8,9,10
GND: C5.2 C6.1 IC2.2(GND) IC3.2(A1) IC3.3(A2) IC3.4(GND) IC3.7(WP) IC17.2(GND) R29.2 SD1.6(GND) SD1.P1(SHIELD) SD1.P2(SHIELD) SD1.P3(SHIELD) SD1.P4(SHIELD) SD1.SWB(B) ST9.5(GND) ST9.M1(SH1) ST9.M2(SH2) ST9.M3(SH3) ST9.M6(SH4) ST15.5 ST15.M1(S1) ST15.M2(S2) ST15.M3(S3) ST15.M4(S4) T2.E ; also sheet 1,2,3,4,5,8,9,10
N$16: LED2.C T2.C
N$17: LED1.A R3.2
N$18: LED2.A R5.2
N$19: R4.1 T2.B
N$20: FB3.1 IC2.1(OUT) R4.2 R14.1
N$21: D1.1(A) R14.2
N$22: IC2.3(!OC) LED1.C R2.2
N$23: R9.1 SD1.SWA(A)
N$24: R28.2 ST15.1
N$26: R34.1 ST15.2
N$27: R35.1 ST15.3
N$32: FB3.2 IC17.5(VBUS) ST9.1(VBUS)
N$34: IC17.6(I/O1) ST9.3(D+)
N$35 [0.5A]: FB2.1 IC2.5(IN)
N$36: IC17.4(I/O2) ST9.2(D-)
N$37 [24V AC Signal]: C5.1 FB4.1 R10.1 SD1.4(VCC)
N$38 [24V AC Signal]: C6.2 FB5.1 IC3.1(A0) IC3.8(VCC)
PA11_USB-DEBUG-D-: R34.2 ; also sheet 1
PA12_USB-DEBUG-D+: R35.2 ; also sheet 1
PB6_I2C1-SCL: IC3.6(SCL) ; also sheet 1,2
PB7_I2C1-SDA: IC3.5(SDA) ; also sheet 1,2
PB14_USBHOST-D-: IC17.3(I/O2) ; also sheet 1
PB15_USBHODT-D+: IC17.1(I/O1) ; also sheet 1
PC5_USB-VBUS: D1.3(C) ; also sheet 1
PC6_USB-PSW: IC2.4(!EN) R1.2 ; also sheet 1
PC8_SDCARD-D0: SD1.7(DATA0/DO) ; also sheet 1
PC9_SDCARD-D1: SD1.8(DATA1) ; also sheet 1
PC10_SDCARD-D2: SD1.1(DATA2) ; also sheet 1
PC11_SDCARD-D3: SD1.2(DATA3-CD/CS) ; also sheet 1
PC12_SDCARD-CLK: SD1.5(CLK) ; also sheet 1
PD2_SDCARD-CMD: SD1.3(CMD/DI) ; also sheet 1
PD7_USB-DETECT: R28.1 R29.1 ; also sheet 1
PE8_SDCARD-CD: R9.2 R10.2 ; also sheet 1
Unconnected: ST9.4(ID) ST15.4

### Notes on the sheet
- (c) 2017 n-tree solutions Ticketsysteme GmbH
- USB-HOST
- SD-Card
- I2C EEPROM
- USB-Debug
- CPU-Board II V3
- USB / Memory | 1

## Sheet 7 of 10: Relais
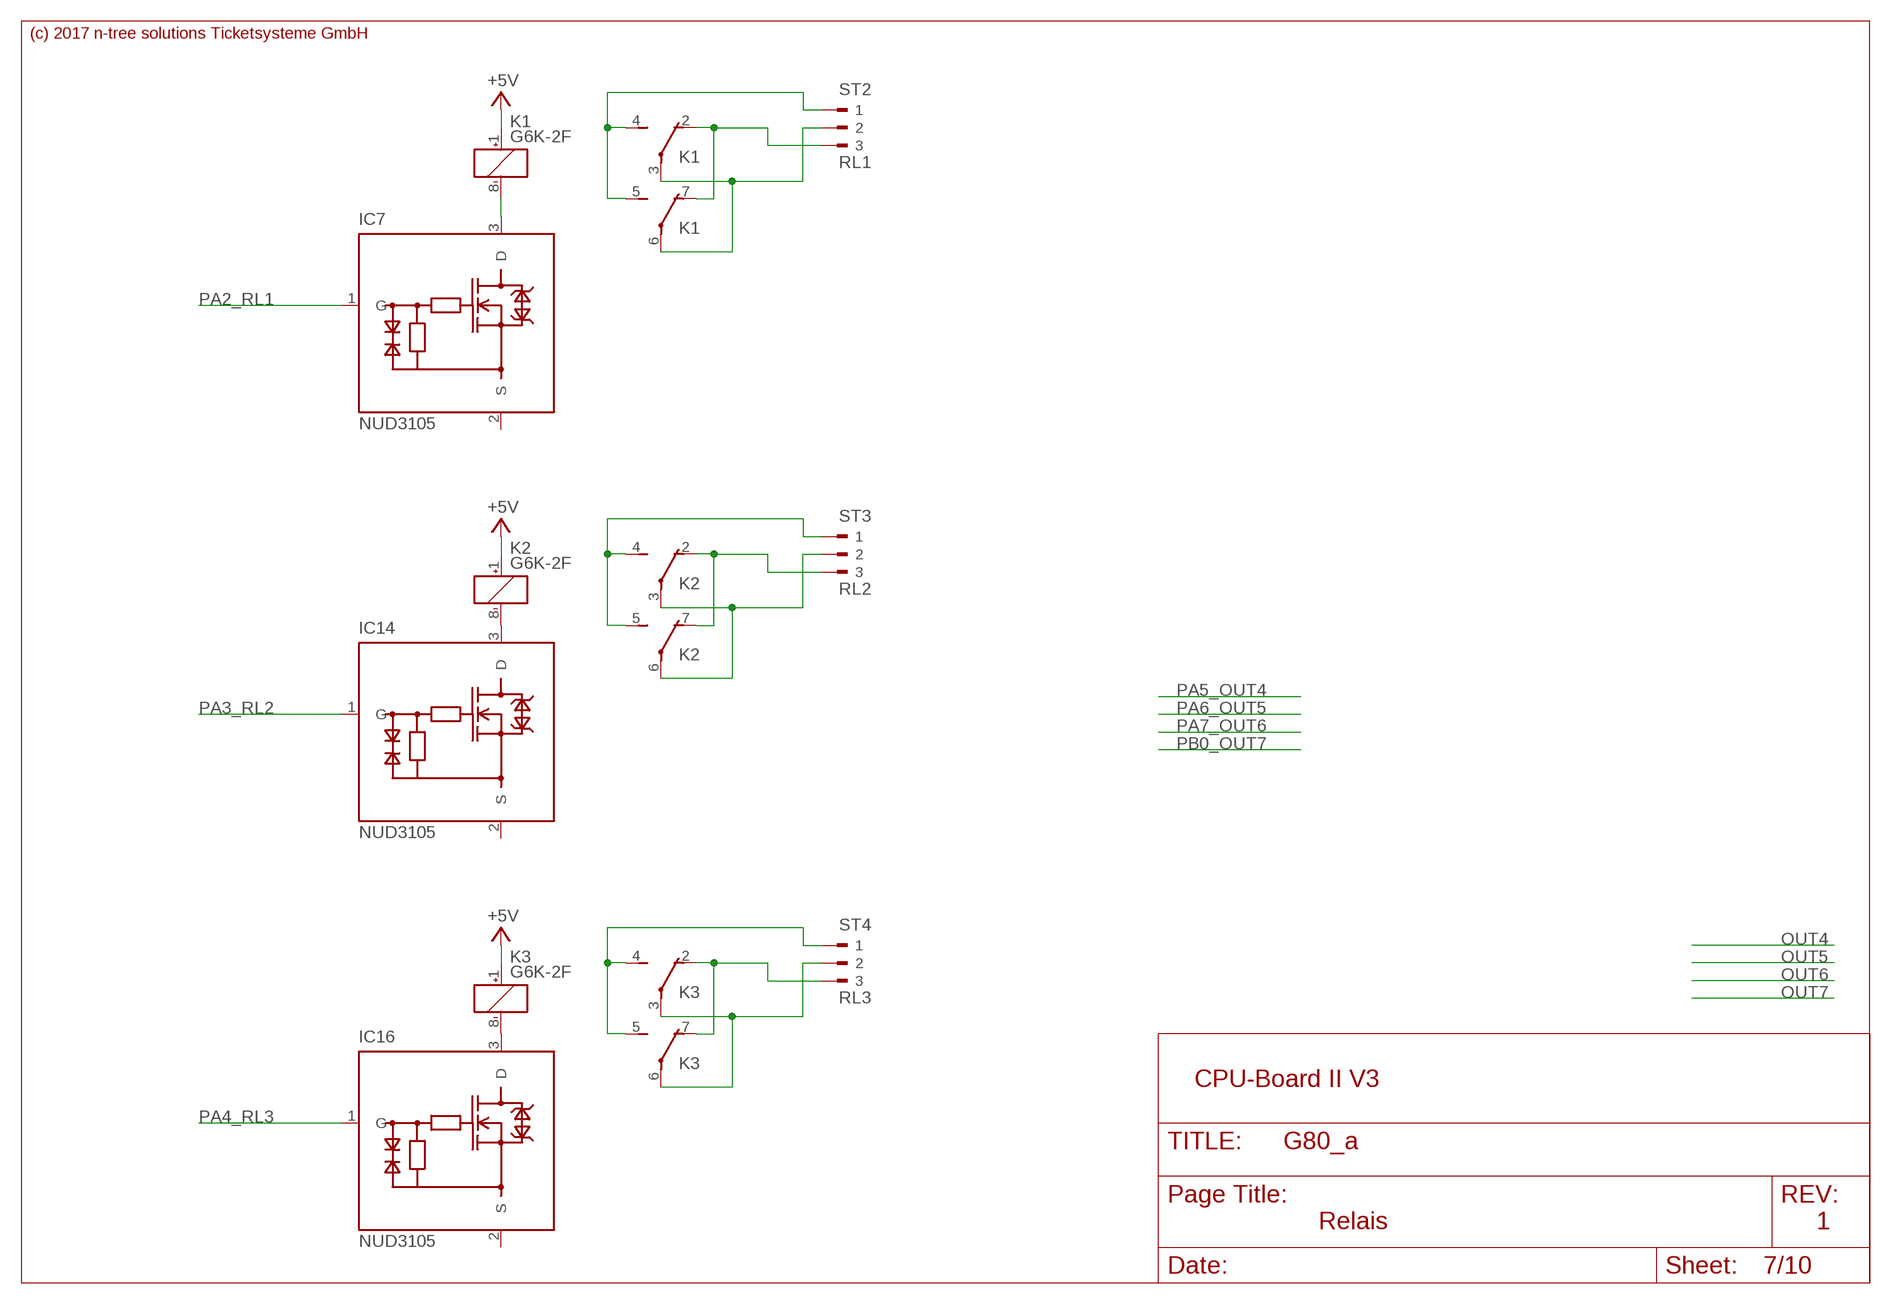
[diagram p6: schematic, sheet 7]

### Parts
IC7  NUD3105  [SOT23]
IC14  NUD3105  [SOT23]
IC16  NUD3105  [SOT23]
K1  G6K-2F  [G6K-2F]
K2  G6K-2F  [G6K-2F]
K3  G6K-2F  [G6K-2F]
ST2  RL1  180G-3  [180G-3]
ST3  RL2  180G-3  [180G-3]
ST4  RL3  180G-3  [180G-3]

### Nets
+5V [24V AC Signal]: K1.1(1:+) K2.1(1:+) K3.1(1:+) ; also sheet 1,2,4,5,6,8,9,10
N$42 [24V AC Signal]: K3.4(2:S) K3.5(3:S) ST4.1
N$43 [24V AC Signal]: K3.2(2:O) K3.7(3:O) ST4.3
N$44 [24V AC Signal]: K3.3(2:P) K3.6(3:P) ST4.2
N$46 [24V AC Signal]: K2.4(2:S) K2.5(3:S) ST3.1
N$47 [24V AC Signal]: K2.2(2:O) K2.7(3:O) ST3.3
N$48 [24V AC Signal]: K2.3(2:P) K2.6(3:P) ST3.2
N$50 [24V AC Signal]: K1.4(2:S) K1.5(3:S) ST2.1
N$51 [24V AC Signal]: K1.2(2:O) K1.7(3:O) ST2.3
N$52 [24V AC Signal]: K1.3(2:P) K1.6(3:P) ST2.2
N$82: IC7.3(D) K1.8(1:-)
N$88: IC14.3(D) K2.8(1:-)
N$91: IC16.3(D) K3.8(1:-)
PA2_RL1: IC7.1(G) ; also sheet 1
PA3_RL2: IC14.1(G) ; also sheet 1
PA4_RL3: IC16.1(G) ; also sheet 1
Unconnected: IC7.2(S) IC14.2(S) IC16.2(S)

### Notes on the sheet
- (c) 2017 n-tree solutions Ticketsysteme GmbH
- CPU-Board II V3
- Relais | 1

## Sheet 8 of 10: Inputs
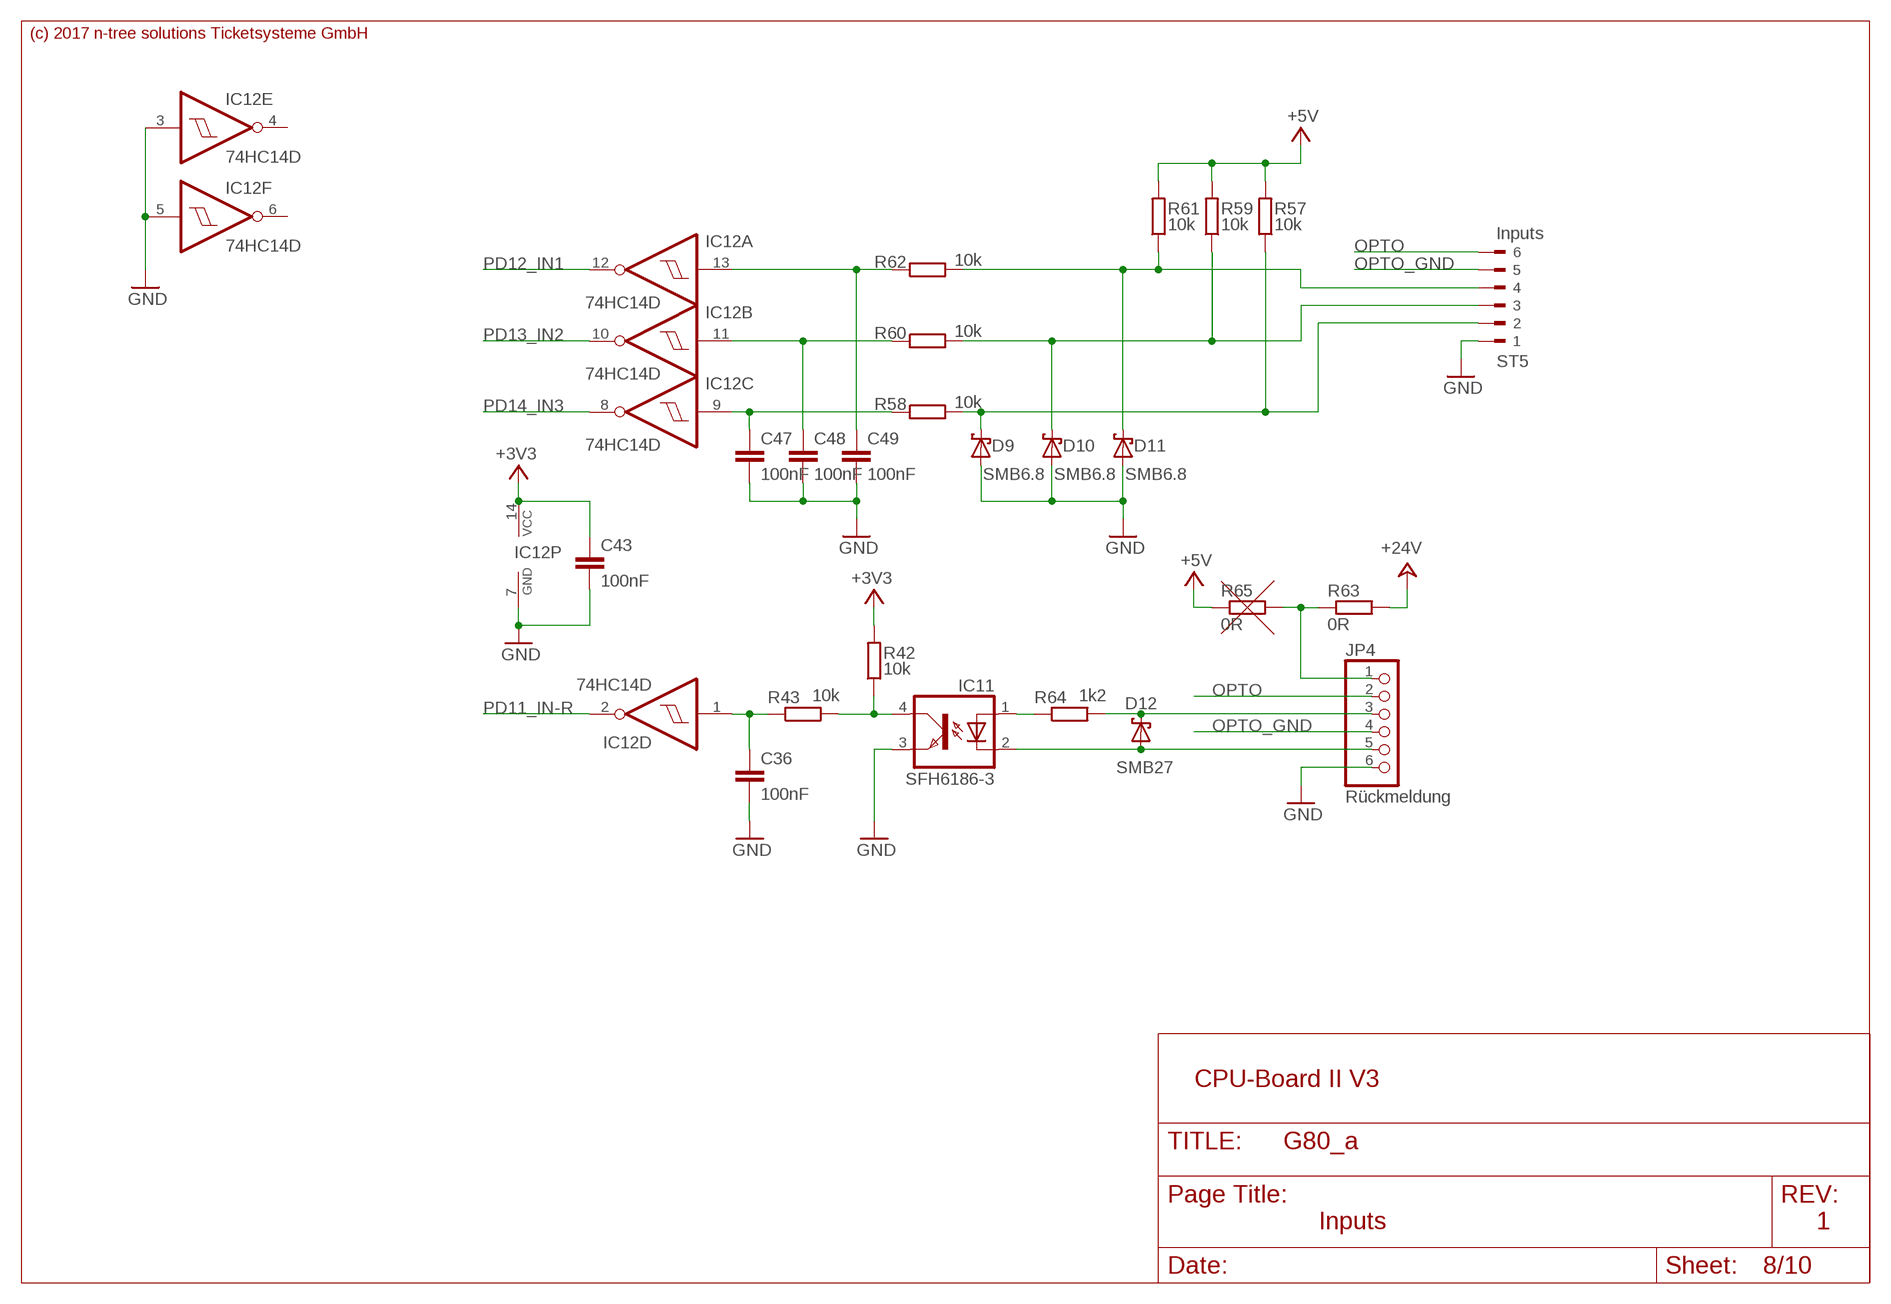
[diagram p7: schematic, sheet 8]

### Parts
C36  100nF  C-EUC0603  [C0603]
C43  100nF  C-EUC0603  [C0603]
C47  100nF  C-EUC0603  [C0603]
C48  100nF  C-EUC0603  [C0603]
C49  100nF  C-EUC0603  [C0603]
D9  SMB6.8  SCHOTTKY-DIODESMD  [SMB]
D10  SMB6.8  SCHOTTKY-DIODESMD  [SMB]
D11  SMB6.8  SCHOTTKY-DIODESMD  [SMB]
D12  SMB27  SCHOTTKY-DIODESMD  [SMB]
IC11  SFH6186-3  SHF6186-3  [SO-6/4]
IC12  74HC14D  [SO14]
JP4  Rückmeldung  PINHD-1X6  [1X06]
R42  10k  R-EU_R0603  [R0603]
R43  10k  R-EU_R0603  [R0603]
R57  10k  R-EU_R0603  [R0603]
R58  10k  R-EU_R0603  [R0603]
R59  10k  R-EU_R0603  [R0603]
R60  10k  R-EU_R0603  [R0603]
R61  10k  R-EU_R0603  [R0603]
R62  10k  R-EU_R0603  [R0603]
R63  0R  R-EU_R0603  [R0603]
R64  1k2  R-EU_R0603  [R0603]
R65  0R  R-EU_R0603  [R0603]
ST5  Inputs  180G-6  [180G-6]

### Nets
+3V3 [24V AC Signal]: C43.1 IC12.14(P:VCC) R42.2 ; also sheet 1,2,3,4,5,6,9,10
+5V [24V AC Signal]: R57.2 R59.2 R61.2 R65.1 ; also sheet 1,2,4,5,6,7,9,10
+24V: R63.2 ; also sheet 10
GND: C36.2 C43.2 C47.2 C48.2 C49.2 D9.A D10.A D11.A IC11.3(EMIT) IC12.3(E:I) IC12.5(F:I) IC12.7(P:GND) JP4.6 ST5.1 ; also sheet 1,2,3,4,5,6,9,10
N$75: JP4.1 R63.1 R65.2
N$79: C36.1 IC12.1(D:I) R43.1
N$84: D9.C R57.1 R58.2 ST5.2
N$85: D10.C R59.1 R60.2 ST5.3
N$86: D11.C R61.1 R62.2 ST5.4
N$87: IC11.4(COL) R42.1 R43.2
N$89 [24V AC Signal]: D12.A IC11.2(C) JP4.5
N$90 [24V AC Signal]: D12.C JP4.3 R64.2
N$93: IC11.1(A) R64.1
N$95: C49.1 IC12.13(A:I) R62.1
N$97: C48.1 IC12.11(B:I) R60.1
N$101: C47.1 IC12.9(C:I) R58.1
OPTO [24V AC Signal]: JP4.2 ST5.6
OPTO_GND [24V AC Signal]: JP4.4 ST5.5
PD11_IN-R: IC12.2(D:O) ; also sheet 1
PD12_IN1: IC12.12(A:O) ; also sheet 1
PD13_IN2: IC12.10(B:O) ; also sheet 1
PD14_IN3: IC12.8(C:O) ; also sheet 1
Unconnected: IC12.4(E:O) IC12.6(F:O)

### Notes on the sheet
- (c) 2017 n-tree solutions Ticketsysteme GmbH
- 1-2;3-4;5-6 --> 24V active
- 2-3:4-5 -----> 24V passive
- Inputs | CPU-Board II V3
- Inputs | 1

## Sheet 9 of 10: HOST RS422
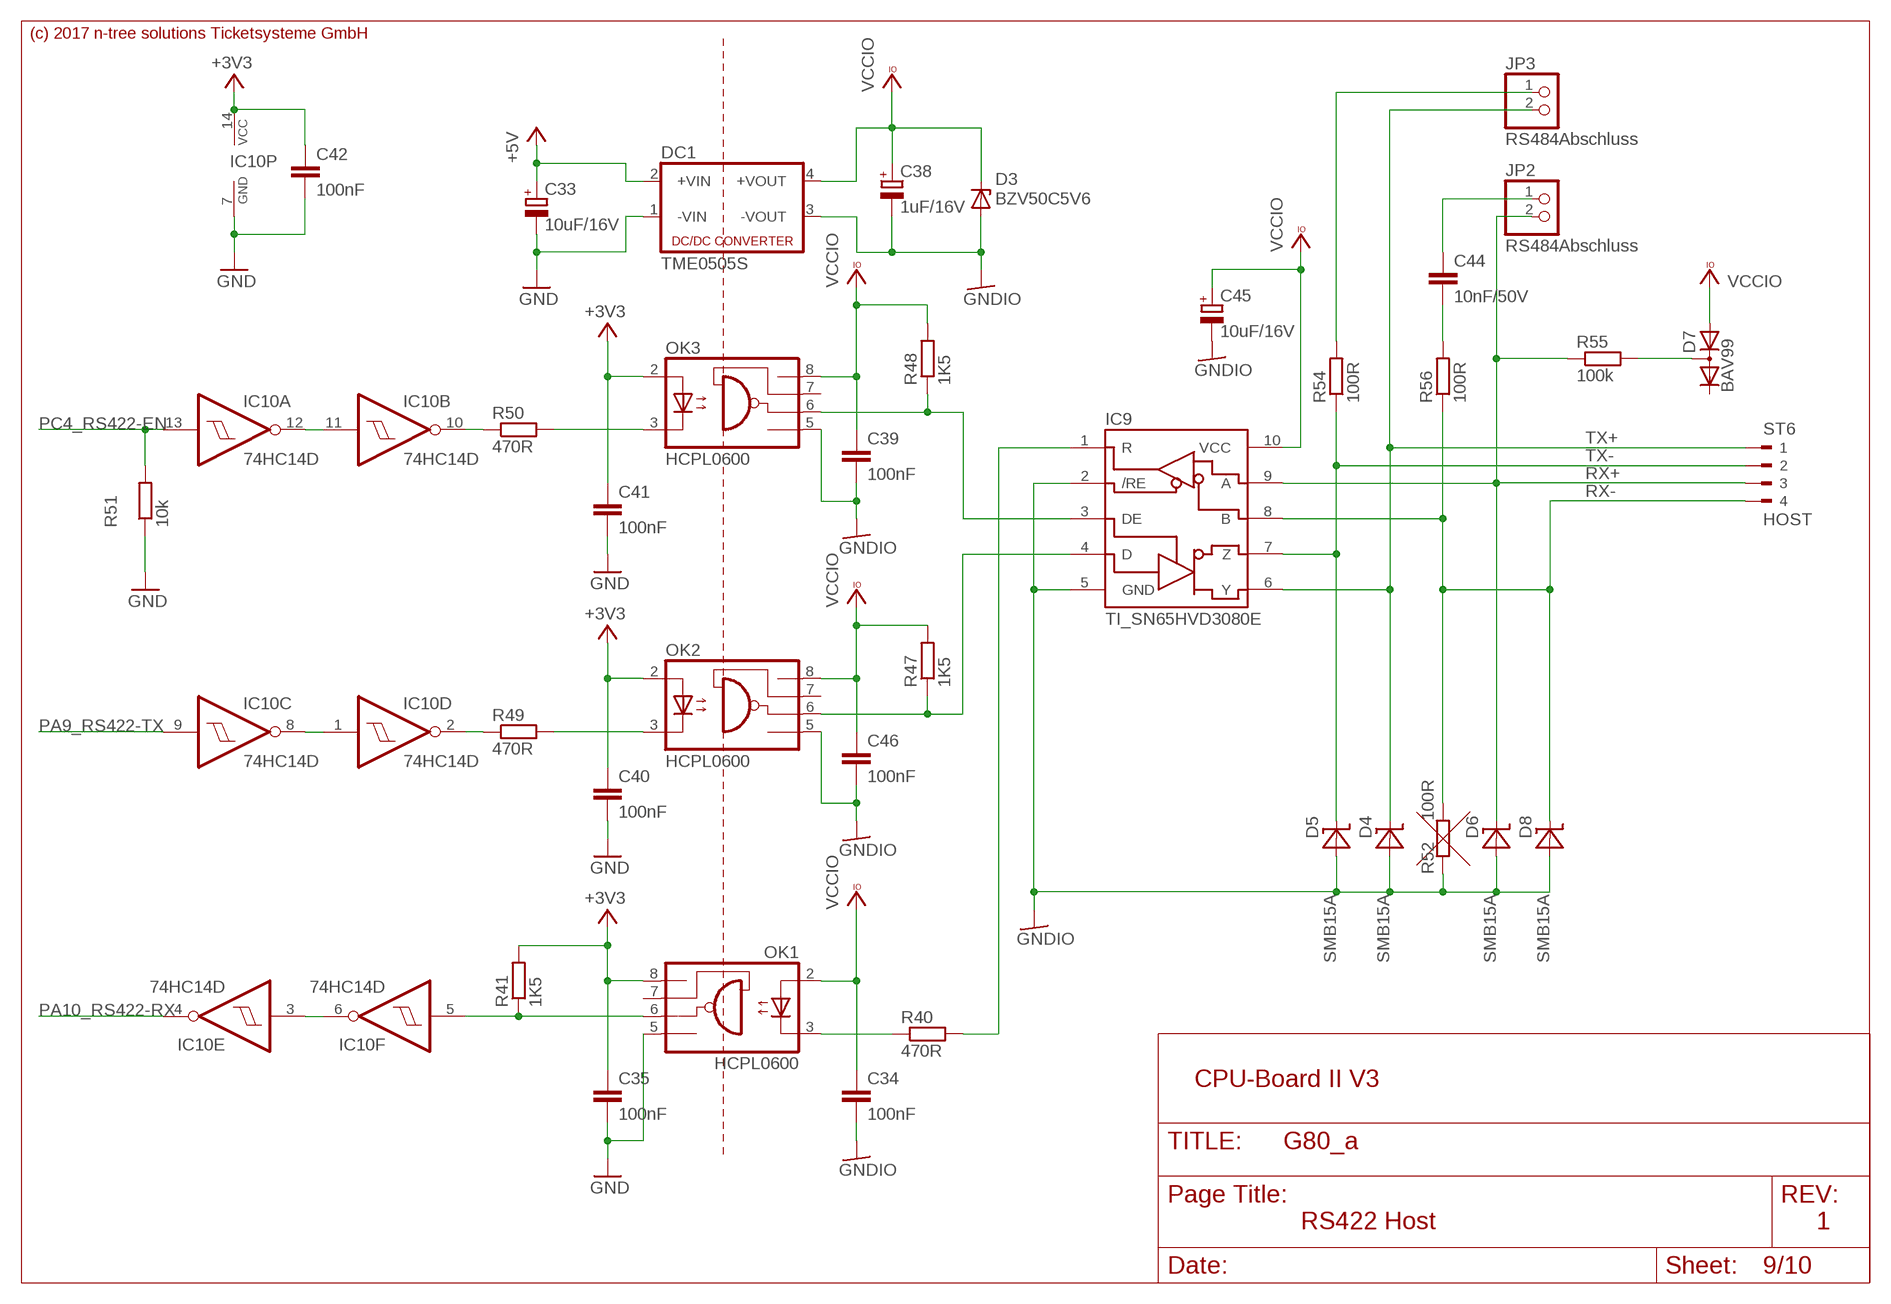
[diagram p8: schematic, sheet 9]

### Parts
C33  10uF/16V  CPOL-EUC/6032-28R  [C/6032-28R]
C34  100nF  C-EUC0603  [C0603]
C35  100nF  C-EUC0603  [C0603]
C38  1uF/16V  CPOL-EUA/3216-18R  [A/3216-18R]
C39  100nF  C-EUC0603  [C0603]
C40  100nF  C-EUC0603  [C0603]
C41  100nF  C-EUC0603  [C0603]
C42  100nF  C-EUC0603  [C0603]
C44  10nF/50V  C-EUC0603  [C0603]
C45  10uF/16V  CPOL-EUC/6032-28R  [C/6032-28R]
C46  100nF  C-EUC0603  [C0603]
D3  BZV50C5V6  ZENER-DIODESOD80C  [SOD80C]
D4  SMB15A  [SMB]
D5  SMB15A  [SMB]
D6  SMB15A  [SMB]
D7  BAV99  [SOT23]
D8  SMB15A  [SMB]
DC1  TME0505S  [NME]
IC9  TI_SN65HVD3080E  [TI_SN65HVD3080E]
IC10  74HC14D  [SO14]
JP2  RS484Abschluss  PINHD-1X2  [1X02]
JP3  RS484Abschluss  PINHD-1X2  [1X02]
OK1  HCPL0600  [SOIC08]
OK2  HCPL0600  [SOIC08]
OK3  HCPL0600  [SOIC08]
R40  470R  R-EU_R0603  [R0603]
R41  1K5  R-EU_R0603  [R0603]
R47  1K5  R-EU_R0603  [R0603]
R48  1K5  R-EU_R0603  [R0603]
R49  470R  R-EU_R0603  [R0603]
R50  470R  R-EU_R0603  [R0603]
R51  10k  R-EU_R0603  [R0603]
R52  100R  R-EU_R0603  [R0603]
R54  100R  R-EU_R0603  [R0603]
R55  100k  R-EU_R0603  [R0603]
R56  100R  R-EU_R0603  [R0603]
ST6  HOST  180G-4  [180G-4]

### Nets
+3V3 [24V AC Signal]: C35.1 C40.1 C41.1 C42.1 IC10.14(P:VCC) OK1.8(VCC) OK2.2(A) OK3.2(A) R41.2 ; also sheet 1,2,3,4,5,6,8,10
+5V [24V AC Signal]: C33.+ DC1.2(+VIN) ; also sheet 1,2,4,5,6,7,8,10
GND: C33.- C35.2 C40.2 C41.2 C42.2 DC1.1(-VIN) IC10.7(P:GND) OK1.5(GND) R51.1 ; also sheet 1,2,3,4,5,6,8,10
GNDIO [0.5A]: C34.2 C38.- C39.2 C45.- C46.2 D3.A D4.2(A) D5.2(A) D6.2(A) D8.2(A) DC1.3(-VOUT) IC9.2(/RE) IC9.5(GND) OK2.5(GND) OK3.5(GND) R52.1
N$40: IC10.11(B:I) IC10.12(A:O)
N$49: IC10.3(E:I) IC10.6(F:O)
N$53: OK3.3(C) R50.2
N$54: IC10.10(B:O) R50.1
N$55: IC10.1(D:I) IC10.8(C:O)
N$56: OK2.3(C) R49.2
N$57: IC10.2(D:O) R49.1
N$58: IC9.4(D) OK2.6(VO) R47.1
N$59: IC10.5(F:I) OK1.6(VO) R41.1
N$60: IC9.1(R) R40.2
N$61: JP3.1 R54.2
N$62 [0.5A]: D7.3(AC) R55.2
N$63: OK1.3(C) R40.1
N$64: IC9.3(DE) OK3.6(VO) R48.1
N$117: C44.1 JP2.1
N$140: C44.2 R56.2
PA9_RS422-TX: IC10.9(C:I) ; also sheet 1
PA10_RS422-RX: IC10.4(E:O) ; also sheet 1
PC4_RS422-EN: IC10.13(A:I) R51.2 ; also sheet 1
RX+: D6.1(C) IC9.9(A) JP2.2 R55.1 ST6.3
RX-: D8.1(C) IC9.8(B) R52.2 R56.1 ST6.4
TX+: D4.1(C) IC9.6(Y) JP3.2 ST6.1
TX-: D5.1(C) IC9.7(Z) R54.1 ST6.2
VCCIO: C34.1 C38.+ C39.1 C45.+ C46.1 D3.C D7.1(A) DC1.4(+VOUT) IC9.10(VCC) OK1.2(A) OK2.8(VCC) OK3.8(VCC) R47.2 R48.2
Unconnected: D7.2(C) OK1.7(VE) OK2.7(VE) OK3.7(VE)

### Notes on the sheet
- (c) 2017 n-tree solutions Ticketsysteme GmbH
- Tx Abschluss
- Rx Abschluss
- CPU-Board II V3
- RS422 Host | 1

## Sheet 10 of 10: Netzteil
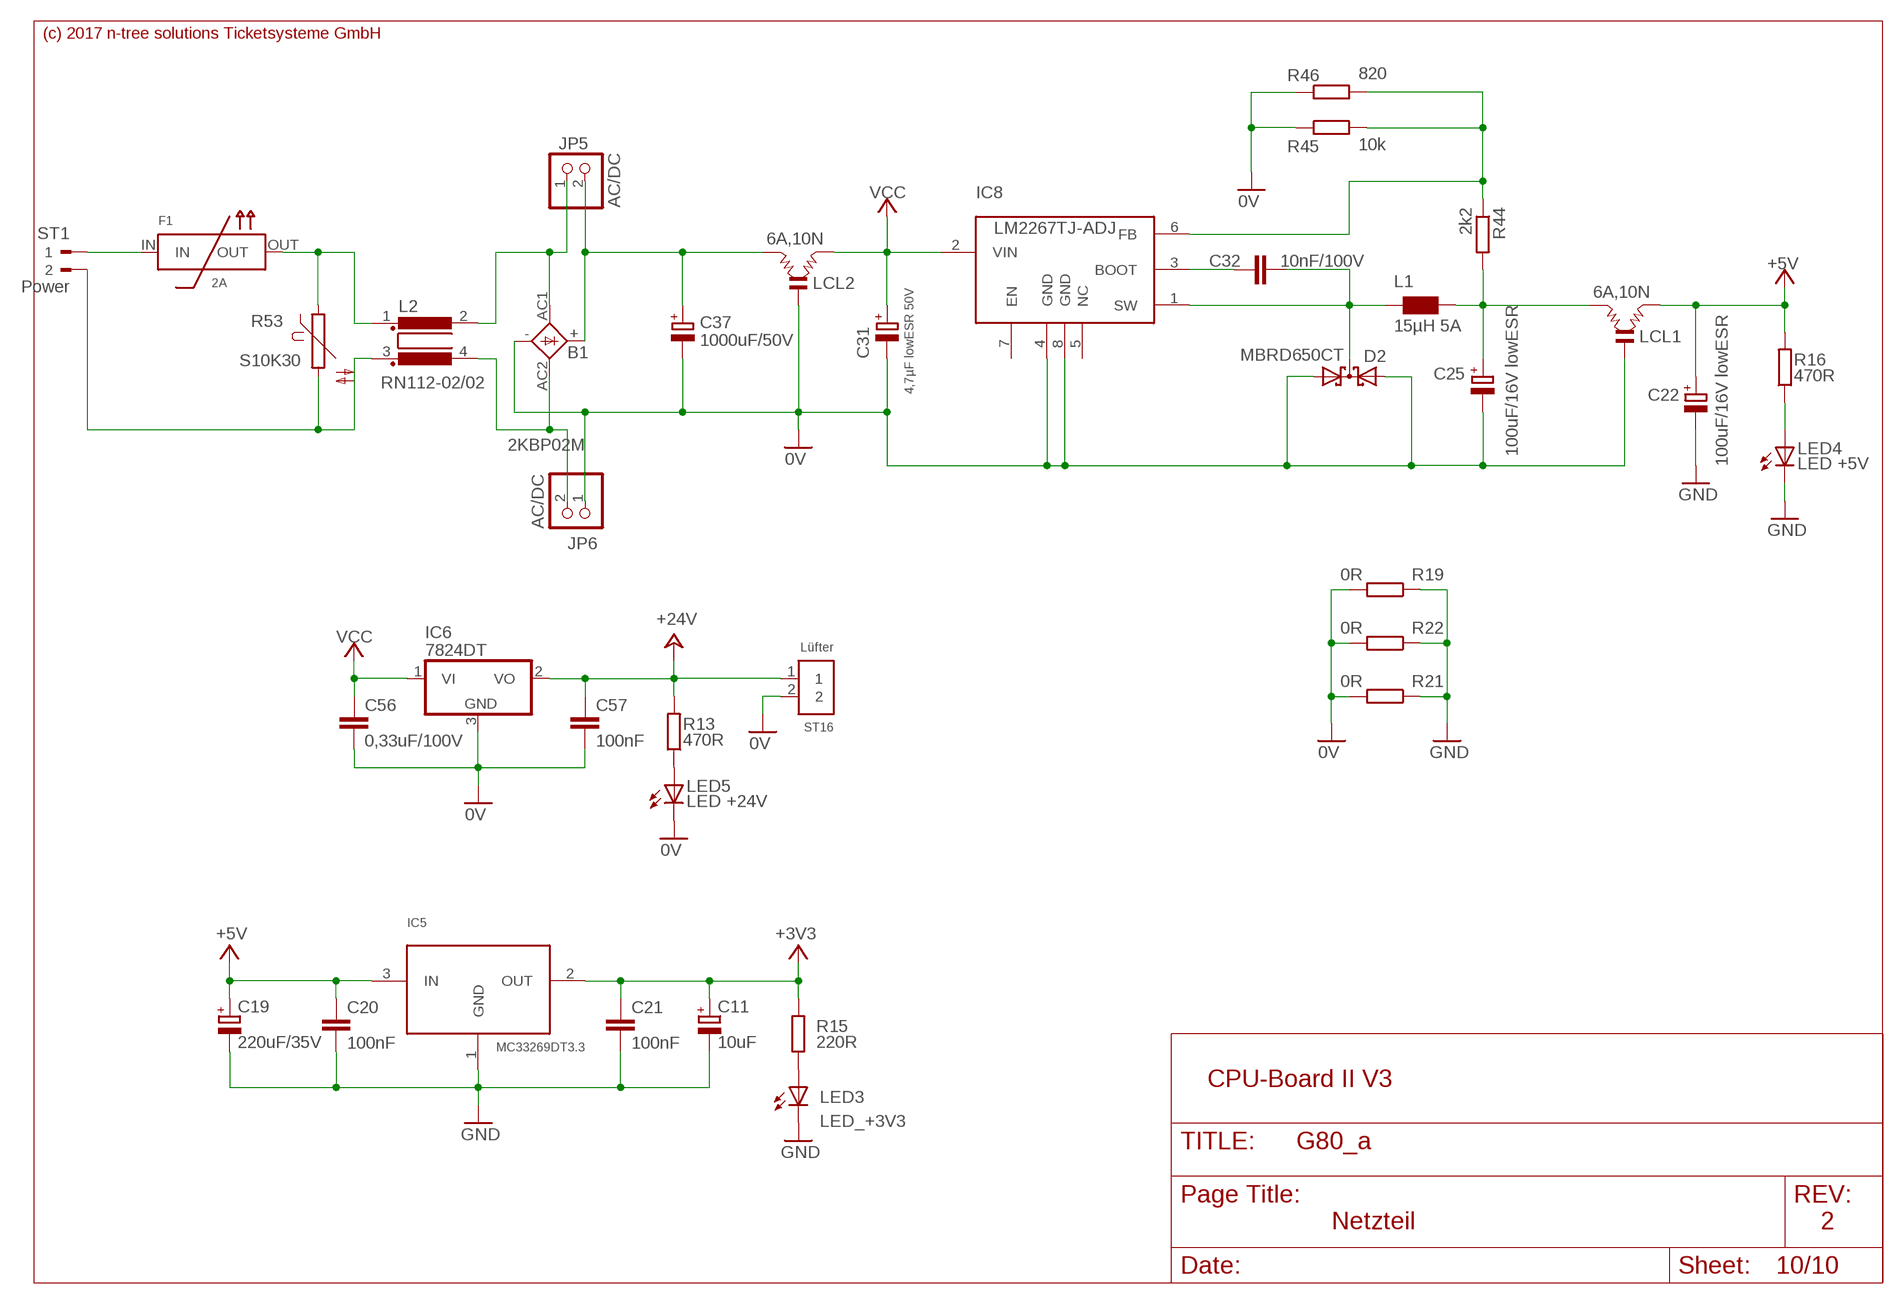
[diagram p9: schematic, sheet 10]

### Parts
B1  2KBP02M  2KBP  [2KBP]
C11  10uF  CPOL-EUC/6032-28R  [C/6032-28R]
C19  220uF/35V  CPOL-EU150CLZ-0810  [150CLZ-0810]
C20  100nF  C-EUC0603  [C0603]
C21  100nF  C-EUC0603  [C0603]
C22  100uF/16V lowESR  CPOL-EUD/7343-31R  [D/7343-31R]
C25  100uF/16V lowESR  CPOL-EUD/7343-31R  [D/7343-31R]
C31  4,7µF lowESR 50V  CPOL-EUD/7343-31R  [D/7343-31R]
C32  10nF/100V  C-EUC0603  [C0603]
C37  1000uF/50V  CPOL-EUE5-13  [E5-13]
C56  0,33uF/100V  C-EUC1206  [C1206]
C57  100nF  C-EUC0603  [C0603]
D2  MBRD650CT  [DPACK_3]
F1  2A  RXEF0252  [RXEF025-2]
IC5  MC33269DT3.3  [D-PAK]
IC6  7824DT  [TO252]
IC8  LM2267TJ-ADJ  LM22678  [TO263-7]
JP5  AC/DC  PINHD-1X2  [1X02]
JP6  AC/DC  PINHD-1X2  [1X02]
L1  15µH 5A  WE-PD_L/XL/XXL  [WE-PD_L/XL/XXL]
L2  RN112-02/02  RN112-2/02  [RN112]
LCL1  6A,10N  DSS6NZ82A103  [T-FILTERSIL]
LCL2  6A,10N  DSS6NZ82A103  [T-FILTERSIL]
LED3  LED_+3V3  LEDCHIPLED_0603  [CHIPLED_0603]
LED4  LED +5V  LEDCHIPLED_0603  [CHIPLED_0603]
LED5  LED +24V  LEDCHIPLED_0603  [CHIPLED_0603]
R13  470R  R-EU_R0603  [R0603]
R15  220R  R-EU_R0603  [R0603]
R16  470R  R-EU_R0603  [R0603]
R19  0R  R-EU_R1206  [R1206]
R21  0R  R-EU_R1206  [R1206]
R22  0R  R-EU_R1206  [R1206]
R44  2k2  R-EU_R0603  [R0603]
R45  10k  R-EU_R0603  [R0603]
R46  820  R-EU_R0603  [R0603]
R53  S10K30  S10K17  [S10K17]
ST1  Power  180G-2  [180G-2]
ST16  Lüfter  JST-EH2  [JST-EH2]

### Nets
0V [2A]: B1.- C25.- C31.- C37.- C56.2 C57.2 D2.1 D2.3 IC6.3(GND) IC8.4(GND) IC8.8(GND) JP6.1 LCL1.2(GND) LCL2.2(GND) LED5.C R19.2 R21.2 R22.2 R45.1 R46.1 ST16.2
+3V3 [24V AC Signal]: C11.+ C21.1 IC5.2(OUT) R15.2 ; also sheet 1,2,3,4,5,6,8,9
+5V [24V AC Signal]: C19.+ C20.1 C22.+ IC5.3(IN) LCL1.3 R16.2 ; also sheet 1,2,4,5,6,7,8,9
+24V: C57.1 IC6.2(VO) R13.2 ST16.1 ; also sheet 8
GND: C11.- C19.- C20.2 C21.2 C22.- IC5.1(GND) LED3.C LED4.C R19.1 R21.1 R22.1 ; also sheet 1,2,3,4,5,6,8,9
N$30: F1.IN ST1.1
N$65 [3A]: L2.3 R53.2 ST1.2
N$66 [3A]: B1.AC1 JP5.1 L2.2
N$67 [3A]: B1.+ C37.+ JP5.2 LCL2.1
N$68: LED4.A R16.1
N$70 [3A]: B1.AC2 JP6.2 L2.4
N$72: LED3.A R15.1
N$83: LED5.A R13.1
N$92 [3A]: F1.OUT L2.1 R53.1
N$96: C32.1 IC8.3(BOOT)
N$98: C32.2 D2.4 IC8.1(SW) L1.2
N$99: IC8.6(FB) R44.1 R45.2 R46.2
N$102 [2A]: C25.+ L1.1 LCL1.1 R44.2
VCC: C31.+ C56.1 IC6.1(VI) IC8.2(VIN) LCL2.3
Unconnected: IC8.5(NC) IC8.7(EN)

### Notes on the sheet
- (c) 2017 n-tree solutions Ticketsysteme GmbH
- Stromkomp. Drossel 2A
- CPU-Board II V3
- Netzteil | 2

## Library data of the parts
B1 = rectifier:2KBP: RECTIFIER grid 3 x 3,81 mm
BAT1 = battery:CH291-1220LF: Battery Holder, SMT, 12mm multicomp PART NO. CH291-1220LF Source: Data sheet <http://www.farnell.com/datasheets/1505860.pdf>
BZ1 = froh:KTG0905CL
C1-C10 C12-C18 C20 C21 C23 C24 C26-C30 C32 C34-C36 C39-C44 C46-C49 C52-C59 = rcl:C-EU: CAPACITOR, European symbol
C11 C19 C22 C25 C31 C33 C37 C38 C45 C50 C51 = rcl:CPOL-EU: POLARIZED CAPACITOR, European symbol
D1 = diode:BAT54: Schottky Diodes Source: Fairchild .. BAT54.pdf
D2 = 11n-treelib:MBRD650CT
D3 = diode:ZENER-DIODE: Z-Diode
D4-D6 D8 = 11n-treelib:SMB15A
D7 = 11n-treelib:BAV99
D9-D12 = diode:SCHOTTKY-DIODE: Schottky Diode
D16 = diode:BAT54C: Schottky Diodes Source: Fairchild .. BAT54.pdf
D17 = diode:BAT54A: Schottky Diodes Source: Fairchild .. BAT54.pdf
DC1 = 11n-treelib:TME0505S: DC-DC CONVERTER
F1 = ntree:RXEF025
FB1-FB7 = froh:FERITTE-CHIP-BEAD
FID1 FID2 = PatternAgents-ProtoPads:FIDUCIAL: Fiducial Alignment Points Various fiducial points for machine vision alignment.
IC1 = froh:G80_SOC: The G80 System on Chip (SoC) is a powerful, low cost 100 pin chipset running the .NET Micro Framework (NETMF) technology. It is programmed using Microsoft's Visual Studio using C# or Visual Basic which allows developers to take advantage of the extensive built-in NETMF libraries and our added extensions. There are no additional licensing fees and all development tools and SDKs are included.
IC2 = froh:TPS2041B
IC3 = microchip:24*: Serial EEPROM I2C; MF: MICROCHIP; MPN: 24AA01-I/SN; OC_FARNELL: 1331268; OC_NEWARK: 92C6793
IC4 = froh:EN28J60SS
IC5 = froh:MC33269DT3.3
IC6 = linear:78*: Positive VOLTAGE REGULATOR Source: http://cache.national.com/ds/LM/LM78L05.pdf http://www.fairchildsemi.com/ds/LM/LM7805.pdf
IC7 IC14 IC16 = ntree:NUD31
IC8 = ntree:LM22678: LM22678-ADJ von National Semiconductor
IC9 = ntree:TI_SN65HVD3080E
IC10 IC12 IC13 = 74xx-eu:74*14: Hex schmitt trigger INVERTER
IC11 = 11n-treelib:SHF6186-3
IC15 = 11n-treelib:P82B96: I2C Buffer mit separatem RX und TX Ausgang
IC17 = froh:USBLC6-2SC6: Very low capacitance ESD protection Features - 2 data-line protection - Protects VBUS - Very low capacitance: 3.5 pF max. - Very low leakage current: 150 nA max. - SOT-666 and SOT23-6L packages - RoHS compliant Benefits - Very low capacitance between lines to GND for optimized data integrity and speed - Low PCB space consumption: 2.9 mm2 max for SOT-666 and 9 mm² max for SOT23-6L - Enhanced ESD protection: IEC 61000-4-2 level 4 compliance guaranteed at device level, hence greater immunity at system level - ESD protection of VBUS - High reliability offered by monolithic integration - Low leakage current for longer operation of battery powered devices - Fast response time Consistent D+ / D- signal balance: – Very low capacitance matching tolerance I/O to GND = 0.015 pF – Compliant with USB 2.0 requirements Complies with the following standards: - IEC 61000-4-2 level 4: – 15 kV (air discharge) – 8 kV (contact discharge)
IC18 = froh:MAX3387E
JP1-JP3 JP5-JP11 = pinhead:PINHD-1X2: PIN HEADER
JP4 = pinhead:PINHD-1X6: PIN HEADER
K1-K3 = relay:G6K: Low Signal Relay oeiwcsnts1.omron.com/.. D20G6K0100.pdf; MF: OMRON COMPONENTS USA; MPN: G6K-2F DC24; OC_FARNELL: 1690427; OC_NEWARK: 36K7467
L1 = wuerth-elektronik:WE-PD: SMD-Shielded Power Inductors WE-PD Is recommended for the application with switching regulators from National Semiconductor, Linear Technology, Texas Instruments and Fairchild Semiconductor - Magnetically shielded version which results in a low leakage field - High storage capacity - Low self-losses -- Switching regulators with low operating voltages (computer, laptop, mobile phones, pagers) -- Integrated DC/DC-converter
L2 = 11n-treelib:RN112-2/02
LCL1 LCL2 = 11n-treelib:DSS6NZ82A103
LED1-LED5 = led:LED: LED OSRAM: - CHIPLED LG R971, LG N971, LY N971, LG Q971, LY Q971, LO R971, LY R971 LH N974, LH R974 LS Q976, LO Q976, LY Q976 LO Q996 - Hyper CHIPLED LW Q18S LB Q993, LB Q99A, LB R99A - SideLED LS A670, LO A670, LY A670, LG A670, LP A670 LB A673, LV A673, LT A673, LW A673 LH A674 LY A675 LS A676, LA A676, LO A676, LY A676, LW A676 LS A679, LY A679, LG A679 - Hyper Micro SIDELED® LS Y876, LA Y876, LO Y876, LY Y876 LT Y87S - SmartLED LW L88C, LW L88S LB L89C, LB L89S, LG L890 LS L89K, LO L89K, LY L89K LS L896, LA L896, LO L896, LY L896 - TOPLED LS T670, LO T670, LY T670, LG T670, LP T670 LSG T670, LSP T670, LSY T670, LOP T670, LYG T670 LG T671, LOG T671, LSG T671 LB T673, LV T673, LT T673, LW T673 LH T674 LS T676, LA T676, LO T676, LY T676, LB T676, LH T676, LSB T676, LW T676 LB T67C, LV T67C, LT T67C, LS T67K, LO T67K, LY T67K, LW E67C LS E67B, LA E67B, LO E67B, LY E67B, LB E67C, LV E67C, LT E67C LW T67C LS T679, LY T679, LG T679 LS T770, LO T770, LY T770, LG T770, LP T770 LB T773, LV T773, LT T773, LW T773 LH T774 LS E675, LA E675, LY E675, LS T675 LS T776, LA T776, LO T776, LY T776, LB T776 LHGB T686 LT T68C, LB T68C - Hyper Mini TOPLED® LB M676 - Mini TOPLED Santana® LG M470 LS M47K, LO M47K, LY M47K Source: http://www.osram.convergy.de LUXEON: - LUMILED® LXK2-PW12-R00, LXK2-PW12-S00, LXK2-PW14-U00, LXK2-PW14-V00 LXK2-PM12-R00, LXK2-PM12-S00, LXK2-PM14-U00 LXK2-PE12-Q00, LXK2-PE12-R00, LXK2-PE12-S00, LXK2-PE14-T00, LXK2-PE14-U00 LXK2-PB12-K00, LXK2-PB12-L00, LXK2-PB12-M00, LXK2-PB14-N00, LXK2-PB14-P00, LXK2-PB14-Q00 LXK2-PR12-L00, LXK2-PR12-M00, LXK2-PR14-Q00, LXK2-PR14-R00 LXK2-PD12-Q00, LXK2-PD12-R00, LXK2-PD12-S00 LXK2-PH12-R00, LXK2-PH12-S00 LXK2-PL12-P00, LXK2-PL12-Q00, LXK2-PL12-R00 Source: www.luxeon.com KINGBRIGHT: KA-3528ASYC Source: www.kingbright.com
LOGO1 = SparkFun-Aesthetics:ROHS_LOGO: Restriction of Hazardous Substances (RoHS) Logo Logo for RoHS-certified hardware.
OK1-OK3 = optocoupler:HCPL0600: HEWLETT PACKARD OPTO COUPLER; MF: AGILENT TECHNOLOGIES; MPN: HCPL-0600-000E; OC_FARNELL: 9994696; OC_NEWARK: 88H7774
Q1 Q3 = crystal:CRYSTAL: CRYSTAL; OC_FARNELL: unknown; OC_NEWARK: unknown
Q2 = IQD-Frequency-Products:CRYSTALS-NOGND: CRYSTALS CAN NOT GROUNDED
Q4 = SparkFun-DiscreteSemi:MOSFET-NCH: N-channel MOSFETs Voltage controlled devices that allow control of high current outputs. SparkFun Products: SparkFun OpenScale <https://www.sparkfun.com/products/13261> SparkFun Digital Sandbox <https://www.sparkfun.com/products/12651> SparkFun Monster Moto Shield <https://www.sparkfun.com/products/10182> SparkFun MOSFET Power Controller <https://www.sparkfun.com/products/11214>; PROD_ID: TRANS-00830; VALUE: 220mA/50V/3.5Ω
R1-R36 R40-R52 R54-R71 = rcl:R-EU_: RESISTOR, European symbol
R53 = varistor:S10K17: VARISTOR
SD1 = DM3AT-SF-PEJM5:DM3AT-SF-PEJM5: DM3 Series 8 Position Right Angle SMT Push Push Ejection MicroSD Card Connector; AVAILABILITY: Good; DESCRIPTION: DM3%20Series%208%20Position%20Right%20Angle%20SMT%20Push%20Push%20Ejection%20MicroSD%20Card%20Connector; MF: Hirose; MP: DM3AT-SF-PEJM5; PACKAGE: None; PRICE: 1.97 USD
ST1 = con-weidmueller-sl35:180G-2: WEIDMUELLER CLAMP CONNECTOR; OC_FARNELL: unknown; OC_NEWARK: unknown
ST2-ST4 = con-weidmueller-sl35:180G-3: WEIDMUELLER CLAMP CONNECTOR; OC_FARNELL: unknown; OC_NEWARK: unknown
ST5 = con-weidmueller-sl35:180G-6: WEIDMUELLER CLAMP CONNECTOR; OC_FARNELL: unknown; OC_NEWARK: unknown
ST6 = con-weidmueller-sl35:180G-4: WEIDMUELLER CLAMP CONNECTOR; OC_FARNELL: unknown; OC_NEWARK: unknown
ST7 = con-pulse:J1011F: PULSEJACK (TM) 1x1 Tab-UP RJ45 10/100 Base-TX RJ45 1x1 Tab-UP with LEDs 8-pin (J1 series) and 6-pin (JP series) integrated magnetics connector, designed to support applications, such as ADSL modems, LAN-on-Motherboard, and Hub and Switches. Source: www.pulseeng.com .. PulseJack-J402.pdf; OC_FARNELL: unknown; OC_NEWARK: unknown
ST8 = con-molex:52745-2090: FFC/FPC-to-Board 0.50mm (.020") SMT Top Contact Right Angle, ZIF, Style Receptacle 52745 / 52435 Source: http://www.molex.com/product/ffc/52745.html; MF: WALDOM/MOLEX; MPN: 52745-2090; OC_FARNELL: unknown; OC_NEWARK: 38C9891
ST9 = 47346-0001:47346-0001: CONN RCPT 5POS MICRO USB R/A SMD; AVAILABILITY: Good; DESCRIPTION: Micro-USB%20B%20Receptacle%20with%20Flange%2C%20Bottom%20Mount%2C%20SMT%2C%20Lead-Free; MF: Molex; MP: 47346-0001; PACKAGE: None; PRICE: 0.54 USD
ST10 ST11 ST13 = ntree:JST-EH5: Einbau-Stecker Fa. JST Typ EH 5pol, RM 2.5mm
ST12 ST14 = pinhead:PINHD-2X8: PIN HEADER
ST15 = con-hirose:MINI-USB-SHIELD-: MINI USB Connector Source: http://www.hirose.co.jp/cataloge_hp/e24000019.pdf; OC_FARNELL: unknown; OC_NEWARK: unknown
ST16 = ntree:JST-EH2
T1 = transistor:BC846: NPN TRANSISTOR
T2 = transistor:*-NPN-: NPN Transistror BF959 corrected 2008.03.06

## Net classes
0 default: width 0.254 mm, drill 0.5 mm, clearance 0.254 mm
1 0.5A: width 0.254 mm, drill 0.6 mm, clearance 0.254 mm
2 24V AC Signal: width 1.524 mm, drill 0.6 mm, clearance 0.305 mm
3 2A: width 1.016 mm, drill 0.6 mm, clearance 0.305 mm
4 3A: width 1.524 mm, drill 0.6 mm, clearance 0.305 mm